# EasyEDA Pro project ProProject_LED电子时钟_2024-05-19.epro

# Schematic Schematic1
Create Date: 2024-05-07; Page Name: P1; Project Name: LED电子时钟; Schematic Name: Schematic1; Update Date: 2024-05-07; Company: 嘉立创EDA; Page Size: A4; Version: V1.0
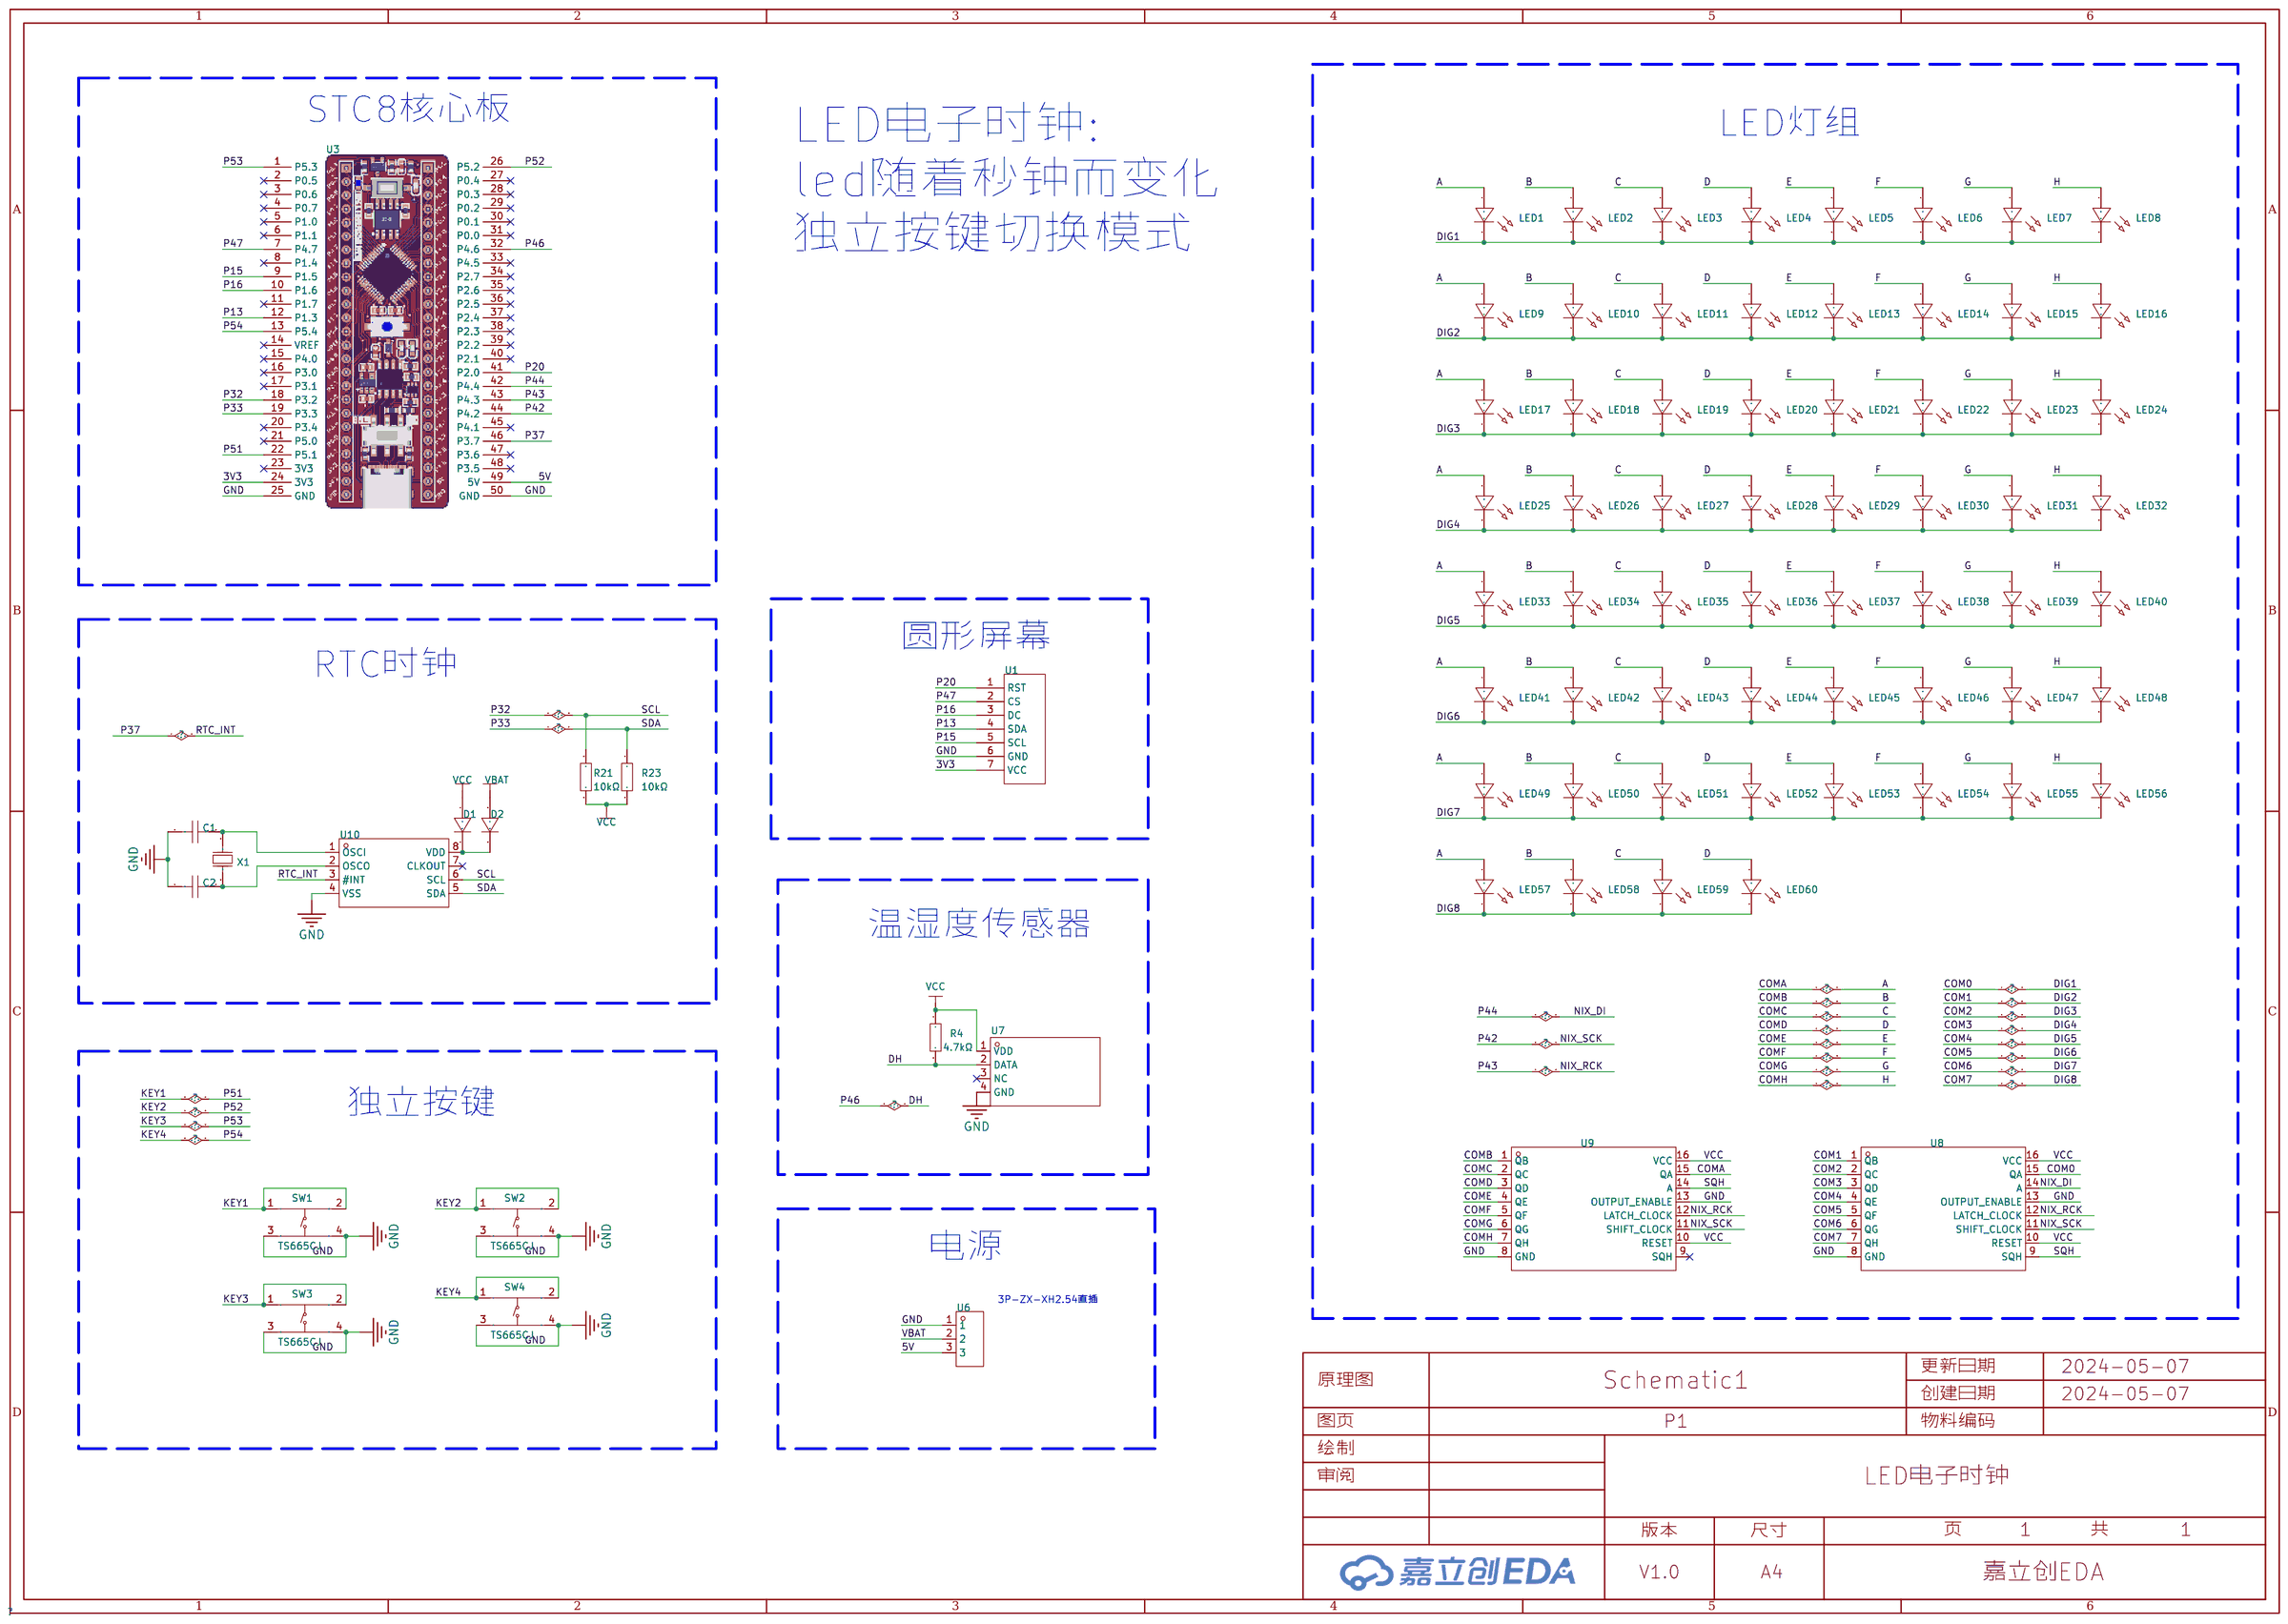
[diagram p0: schematic sheet]

## Parts
C1  12pF  [CAP-TH_L6.0-W6.0-P2.54-D1.0]
C2  12pF  [CAP-TH_L6.0-W6.0-P2.54-D1.0]
D1  -  [DO-15_BD3.1-L6.7-P10.70-D0.9-RD]
D2  -  [DO-15_BD3.1-L6.7-P10.70-D0.9-RD]
LED1  -  [LED-TH_BD3.0-P2.54-FD]
LED2  -  [LED-TH_BD3.0-P2.54-FD]
LED3  -  [LED-TH_BD3.0-P2.54-FD]
LED4  -  [LED-TH_BD3.0-P2.54-FD]
LED5  -  [LED-TH_BD3.0-P2.54-FD]
LED6  -  [LED-TH_BD3.0-P2.54-FD]
LED7  -  [LED-TH_BD3.0-P2.54-FD]
LED8  -  [LED-TH_BD3.0-P2.54-FD]
LED9  -  [LED-TH_BD3.0-P2.54-FD]
LED10  -  [LED-TH_BD3.0-P2.54-FD]
LED11  -  [LED-TH_BD3.0-P2.54-FD]
LED12  -  [LED-TH_BD3.0-P2.54-FD]
LED13  -  [LED-TH_BD3.0-P2.54-FD]
LED14  -  [LED-TH_BD3.0-P2.54-FD]
LED15  -  [LED-TH_BD3.0-P2.54-FD]
LED16  -  [LED-TH_BD3.0-P2.54-FD]
LED17  -  [LED-TH_BD3.0-P2.54-FD]
LED18  -  [LED-TH_BD3.0-P2.54-FD]
LED19  -  [LED-TH_BD3.0-P2.54-FD]
LED20  -  [LED-TH_BD3.0-P2.54-FD]
LED21  -  [LED-TH_BD3.0-P2.54-FD]
LED22  -  [LED-TH_BD3.0-P2.54-FD]
LED23  -  [LED-TH_BD3.0-P2.54-FD]
LED24  -  [LED-TH_BD3.0-P2.54-FD]
LED25  -  [LED-TH_BD3.0-P2.54-FD]
LED26  -  [LED-TH_BD3.0-P2.54-FD]
LED27  -  [LED-TH_BD3.0-P2.54-FD]
LED28  -  [LED-TH_BD3.0-P2.54-FD]
LED29  -  [LED-TH_BD3.0-P2.54-FD]
LED30  -  [LED-TH_BD3.0-P2.54-FD]
LED31  -  [LED-TH_BD3.0-P2.54-FD]
LED32  -  [LED-TH_BD3.0-P2.54-FD]
LED33  -  [LED-TH_BD3.0-P2.54-FD]
LED34  -  [LED-TH_BD3.0-P2.54-FD]
LED35  -  [LED-TH_BD3.0-P2.54-FD]
LED36  -  [LED-TH_BD3.0-P2.54-FD]
LED37  -  [LED-TH_BD3.0-P2.54-FD]
LED38  -  [LED-TH_BD3.0-P2.54-FD]
LED39  -  [LED-TH_BD3.0-P2.54-FD]
LED40  -  [LED-TH_BD3.0-P2.54-FD]
LED41  -  [LED-TH_BD3.0-P2.54-FD]
LED42  -  [LED-TH_BD3.0-P2.54-FD]
LED43  -  [LED-TH_BD3.0-P2.54-FD]
LED44  -  [LED-TH_BD3.0-P2.54-FD]
LED45  -  [LED-TH_BD3.0-P2.54-FD]
LED46  -  [LED-TH_BD3.0-P2.54-FD]
LED47  -  [LED-TH_BD3.0-P2.54-FD]
LED48  -  [LED-TH_BD3.0-P2.54-FD]
LED49  -  [LED-TH_BD3.0-P2.54-FD]
LED50  -  [LED-TH_BD3.0-P2.54-FD]
LED51  -  [LED-TH_BD3.0-P2.54-FD]
LED52  -  [LED-TH_BD3.0-P2.54-FD]
LED53  -  [LED-TH_BD3.0-P2.54-FD]
LED54  -  [LED-TH_BD3.0-P2.54-FD]
LED55  -  [LED-TH_BD3.0-P2.54-FD]
LED56  -  [LED-TH_BD3.0-P2.54-FD]
LED57  -  [LED-TH_BD3.0-P2.54-FD]
LED58  -  [LED-TH_BD3.0-P2.54-FD]
LED59  -  [LED-TH_BD3.0-P2.54-FD]
LED60  -  [LED-TH_BD3.0-P2.54-FD]
R4  4.7kΩ  [RES-TH_BD2.4-L6.3-P10.30-D0.6]
R21  10kΩ  [RES-TH_BD2.4-L6.3-P10.30-D0.6]
R23  10kΩ  [RES-TH_BD2.4-L6.3-P10.30-D0.6]
SW1  TS665CJ  [SW-TH_4P-L6.0-W6.0-P4.50-LS6.5]
SW2  TS665CJ  [SW-TH_4P-L6.0-W6.0-P4.50-LS6.5]
SW3  TS665CJ  [SW-TH_4P-L6.0-W6.0-P4.50-LS6.5]
SW4  TS665CJ  [SW-TH_4P-L6.0-W6.0-P4.50-LS6.5]
U1  -  [1.28寸OLED圆形显示屏]
U3  -  [STC8H8K64U_CORE]
U6  ZX-XH2.54-3PZZ  [CONN-TH_3P-P2.54_2501S-3P]
U7  -  [SENSOR-TH_DHT11]
U8  74HC595N  [DIP-16_L20.0-W6.4-P2.54-LS7.6-BL]
U9  74HC595N  [DIP-16_L20.0-W6.4-P2.54-LS7.6-BL]
U10  PCF8563N  [DIP-8_L9.7-W6.4-P2.54-LS7.6-BL]
X1  32.768kHz  [CRYSTAL-TH_BD2.1-P0.70-D0.3]

## Library data of the parts
C1 C2 = CC1H120KA1PDCH4B3003: 容值:12pF;精度:±10%;额定电压:50V;温度系数:NP0;脚间距:2.54mm;电容体直径:-;电容体厚度:-;; LCSC Part Name: 12pF±10%50V; Supplier Part: C353907; Manufacturer: Dersonic(德尔创); Supplier Footprint: 径向引线,P=2.54mm; JLCPCB Part Class: 扩展库; Datasheet: https://atta.szlcsc.com/upload/public/pdf/source/20181227/C353907_0D58F7ACE4E16D096B8CF295366F24DF.pdf; Supplier: LCSC; Tolerance: ±10%; Voltage Rated: 50V; Temperature Coefficient: NP0; Lead Spacing: 2.54mm
D1 D2 = 1N4004G_C232435: 二极管配置:-;直流反向耐压(Vr):400V;平均整流电流(Io):1A;正向压降(Vf):930mV@1A;反向电流(Ir):50nA@400V;; LCSC Part Name: 1N4004G; Supplier Part: C232435; Manufacturer: onsemi(安森美); Manufacturer Part: 1N4004G; Supplier Footprint: 插件,2x4.1mm; JLCPCB Part Class: 扩展库; Datasheet: https://atta.szlcsc.com/upload/public/pdf/source/20180830/C232435_7A61FC887E00F7CCC341146F4C8EE147.pdf; Supplier: LCSC; Reverse Voltage (Vr): 400V; Average Rectified Current (Io): 1A; Forward Voltage (Vf@If): 930mV@1A; Reverse Leakage Current: 50nA@400V
LED1-LED60 = LED_TH-R_3mm: Supplier Footprint: 插件
R4 R21 R23 = Res_AXIAL-1/4W: Supplier Footprint: 轴向引线
SW1-SW4 = TS665CJ: 电路结构:单刀单掷;按钮形状:圆形按钮;安装方式:直插;开关长度:6mm;开关宽度:6mm;开关高度:5mm;触点电流:50mA;额定电压(DC):12V;带灯:-;机械寿命:-;; LCSC Part Name: 6*6*5mm 直插 轻触开关; Supplier Part: C393938; Manufacturer: SHOU HAN(首韩); Supplier Footprint: 插件; JLCPCB Part Class: 扩展库; Datasheet: https://atta.szlcsc.com/upload/public/pdf/source/20190521/C393938_BDABEAC600B4C55E200A80AA129B70BC.pdf; Supplier: LCSC; Circuit: 单刀单掷; Actuator Style: 圆形按钮; Mounting Style: 直插; Switch Length: 6mm; Switch Width: 6mm; Switch Height: 5mm; Contact Current: 50mA; Voltage Rating (DC): 12V
U1 = 1.28寸圆形OLED
U3 = STC8H8K64U_CORE
U6 = ZX-XH2.54-3PZZ: 插针结构:1x3P;间距:2.54mm;安装方式:直插;参考系列:XH;总PIN数:3P;排数:1;每排PIN数:3;行距:-;额定电流:3A;触头材质:黄铜;触头镀层:锡;工作温度范围:-25℃~+85℃;; Supplier Part: C7429633; Manufacturer: Megastar(兆星); Supplier Footprint: 插件,P=2.54mm; JLCPCB Part Class: 扩展库; Datasheet: https://atta.szlcsc.com/upload/public/pdf/source/20230619/AE17037A2CFDBE8D9CBA775D61AD0A84.pdf; Supplier: LCSC; Pins Structure: 1x3P; Pitch: 2.54mm; Mounting Style: 直插; Reference Series: XH; Number of Pins: 3P; Number of Rows: 1; Number of PINs Per Row: 3; Current Rating (Max): 3A; Contact Material: 黄铜; Contact Plating: 锡; Operating Temperature Range: -25℃~+85℃
U7 = DHT11: 传感器类型:Humidity,Temperature;输出类型:-;温度范围:-;湿度范围:-;精度:-;; LCSC Part Name: DHT11电容式传感器; Supplier Part: C117051; Manufacturer: 广州奥松; Supplier Footprint: 16.1mm*12.6mm*5.8mm; JLCPCB Part Class: 扩展库; Datasheet: https://atta.szlcsc.com/upload/public/pdf/source/20170703/1499081238365.pdf; Supplier: LCSC; Sensor Type: Humidity,Temperature; Voltage-Supply: 3.3V~5.5V
U8 U9 = 74HC595N_C507175: 逻辑电路的归属系列:-;逻辑类型:-;输出类型:-;功能:-;; LCSC Part Name: 具有三态输出寄存器的8位移位寄存器; Supplier Part: C507175; Manufacturer: HGSEMI(华冠); Supplier Footprint: DIP-16; JLCPCB Part Class: 扩展库; Datasheet: https://atta.szlcsc.com/upload/public/pdf/source/20200807/C507175_E34A38F170EDB2B55E02D1AF859C319F.pdf; Supplier: LCSC
U10 = PCF8563N: 低功耗CMOS实时时钟/日历芯片; Supplier Part: C512783; Manufacturer: HGSEMI(华冠); Supplier Footprint: DIP-8; JLCPCB Part Class: 扩展库; Datasheet: https://atta.szlcsc.com/upload/public/pdf/source/20220729/54940189ABAC8F74603EDE43118FBEBE.pdf; Supplier: LCSC
X1 = Y20600327122040: 晶振类型:圆柱体晶振;频率:32.768kHz;频率公差:±10ppm;负载电容:12.5pF;等效串联电阻(ESR):40kΩ;工作温度:-20~+70;; LCSC Part Name: 32.768kHz±10ppm12.5pF; Supplier Part: C555557; Manufacturer: JGHC(晶光华); Supplier Footprint: DT-26; JLCPCB Part Class: 扩展库; Datasheet: https://atta.szlcsc.com/upload/public/pdf/source/20191012/C390737_64D6F856E7650A863FE44EA32FF6806B.pdf; Supplier: LCSC; Crystal Type: 圆柱体晶振; Frequency Tolerance: ±10ppm; Load Capacitance: 12.5pF; Equivalent Series Resistance (ESR): 40kΩ; Operating Temperature: -20~+70

## Nets
3V3: U1.7(VCC) U3.24(3V3)
5V: U3.49(5V) U6.3
GND: C1.1 C2.1 SW1.3(C) SW1.4(D) SW2.3(C) SW2.4(D) SW3.3(C) SW3.4(D) SW4.3(C) SW4.4(D) U1.6(GND) U3.25(GND) U3.50(GND) U6.1 U7.4(GND) U8.8(GND) U8.13(OUTPUT_ENABLE) U9.8(GND) U9.13(OUTPUT_ENABLE) U10.4(VSS)
VBAT: D2.2 U6.2
VCC: D1.2 R4.1 R21.1 R23.1 U7.1(VDD) U8.10(RESET) U8.16(VCC) U9.10(RESET) U9.16(VCC)
A: LED1.1(C) LED9.1(C) LED17.1(C) LED25.1(C) LED33.1(C) LED41.1(C) LED49.1(C) LED57.1(C) U9.15(QA)
B: LED2.1(C) LED10.1(C) LED18.1(C) LED26.1(C) LED34.1(C) LED42.1(C) LED50.1(C) LED58.1(C) U9.1(QB)
C: LED3.1(C) LED11.1(C) LED19.1(C) LED27.1(C) LED35.1(C) LED43.1(C) LED51.1(C) LED59.1(C) U9.2(QC)
COM0: LED1.2(A) LED2.2(A) LED3.2(A) LED4.2(A) LED5.2(A) LED6.2(A) LED7.2(A) LED8.2(A) U8.15(QA)
COM1: LED9.2(A) LED10.2(A) LED11.2(A) LED12.2(A) LED13.2(A) LED14.2(A) LED15.2(A) LED16.2(A) U8.1(QB)
COM2: LED17.2(A) LED18.2(A) LED19.2(A) LED20.2(A) LED21.2(A) LED22.2(A) LED23.2(A) LED24.2(A) U8.2(QC)
COM3: LED25.2(A) LED26.2(A) LED27.2(A) LED28.2(A) LED29.2(A) LED30.2(A) LED31.2(A) LED32.2(A) U8.3(QD)
COM4: LED33.2(A) LED34.2(A) LED35.2(A) LED36.2(A) LED37.2(A) LED38.2(A) LED39.2(A) LED40.2(A) U8.4(QE)
COM5: LED41.2(A) LED42.2(A) LED43.2(A) LED44.2(A) LED45.2(A) LED46.2(A) LED47.2(A) LED48.2(A) U8.5(QF)
COM6: LED49.2(A) LED50.2(A) LED51.2(A) LED52.2(A) LED53.2(A) LED54.2(A) LED55.2(A) LED56.2(A) U8.6(QG)
COM7: LED57.2(A) LED58.2(A) LED59.2(A) LED60.2(A) U8.7(QH)
COMD: LED4.1(C) LED12.1(C) LED20.1(C) LED28.1(C) LED36.1(C) LED44.1(C) LED52.1(C) LED60.1(C) U9.3(QD)
COME: LED5.1(C) LED13.1(C) LED21.1(C) LED29.1(C) LED37.1(C) LED45.1(C) LED53.1(C) U9.4(QE)
COMF: LED6.1(C) LED14.1(C) LED22.1(C) LED30.1(C) LED38.1(C) LED46.1(C) LED54.1(C) U9.5(QF)
COMG: LED7.1(C) LED15.1(C) LED23.1(C) LED31.1(C) LED39.1(C) LED47.1(C) LED55.1(C) U9.6(QG)
COMH: LED8.1(C) LED16.1(C) LED24.1(C) LED32.1(C) LED40.1(C) LED48.1(C) LED56.1(C) U9.7(QH)
DH: R4.2 U3.32(P4.6) U7.2(DATA)
KEY1: SW1.1(A) SW1.2(B) U3.22(P5.1)
KEY2: SW2.1(A) SW2.2(B) U3.26(P5.2)
KEY3: SW3.1(A) SW3.2(B) U3.1(P5.3)
KEY4: SW4.1(A) SW4.2(B) U3.13(P5.4)
NIX_DI: U3.42(P4.4) U8.14(A)
NIX_RCK: U3.43(P4.3) U8.12(LATCH_CLOCK) U9.12(LATCH_CLOCK)
NIX_SCK: U3.44(P4.2) U8.11(SHIFT_CLOCK) U9.11(SHIFT_CLOCK)
P13: U1.4(SDA) U3.12(P1.3)
P15: U1.5(SCL) U3.9(P1.5)
P16: U1.3(DC) U3.10(P1.6)
P20: U1.1(RST) U3.41(P2.0)
P32: R21.2 U3.18(P3.2) U10.6(SCL)
P33: R23.2 U3.19(P3.3) U10.5(SDA)
P37: U3.46(P3.7) U10.3(#INT)
P47: U1.2(CS) U3.7(P4.7)
SQH: U8.9(SQH) U9.14(A)
$1N7289: D1.1 D2.1 U10.8(VDD)
$1N7298: C2.2 U10.2(OSCO) X1.2(OSC2)
$1N7299: C1.2 U10.1(OSCI) X1.1(OSC1)

Not connected (* = marked no-connect by the designer): U3 2(P0.5)* 3(P0.6)* 4(P0.7)* 5(P1.0)* 6(P1.1)* 8(P1.4)* 11(P1.7)* 14(VREF)* 15(P4.0)* 16(P3.0)* 17(P3.1)* 20(P3.4)* 21(P5.0)* 23(3V3)* 27(P0.4)* 28(P0.3)* 29(P0.2)* 30(P0.1)* 31(P0.0)* 33(P4.5)* 34(P2.7)* 35(P2.6)* 36(P2.5)* 37(P2.4)* 38(P2.3)* 39(P2.2)* 40(P2.1)* 45(P4.1)* 47(P3.6)* 48(P3.5)*; U7 3(NC)*; U9 9(SQH)*; U10 7(CLKOUT)*

## Notes on the sheet
- STC8核心板
- LED灯组
- LED电子时钟:
  led随着秒钟而变化
  独立按键切换模式
- 圆形屏幕
- RTC时钟
- 温湿度传感器
- 独立按键
- 电源
- 3P-ZX-XH2.54直插

# Board PCB1
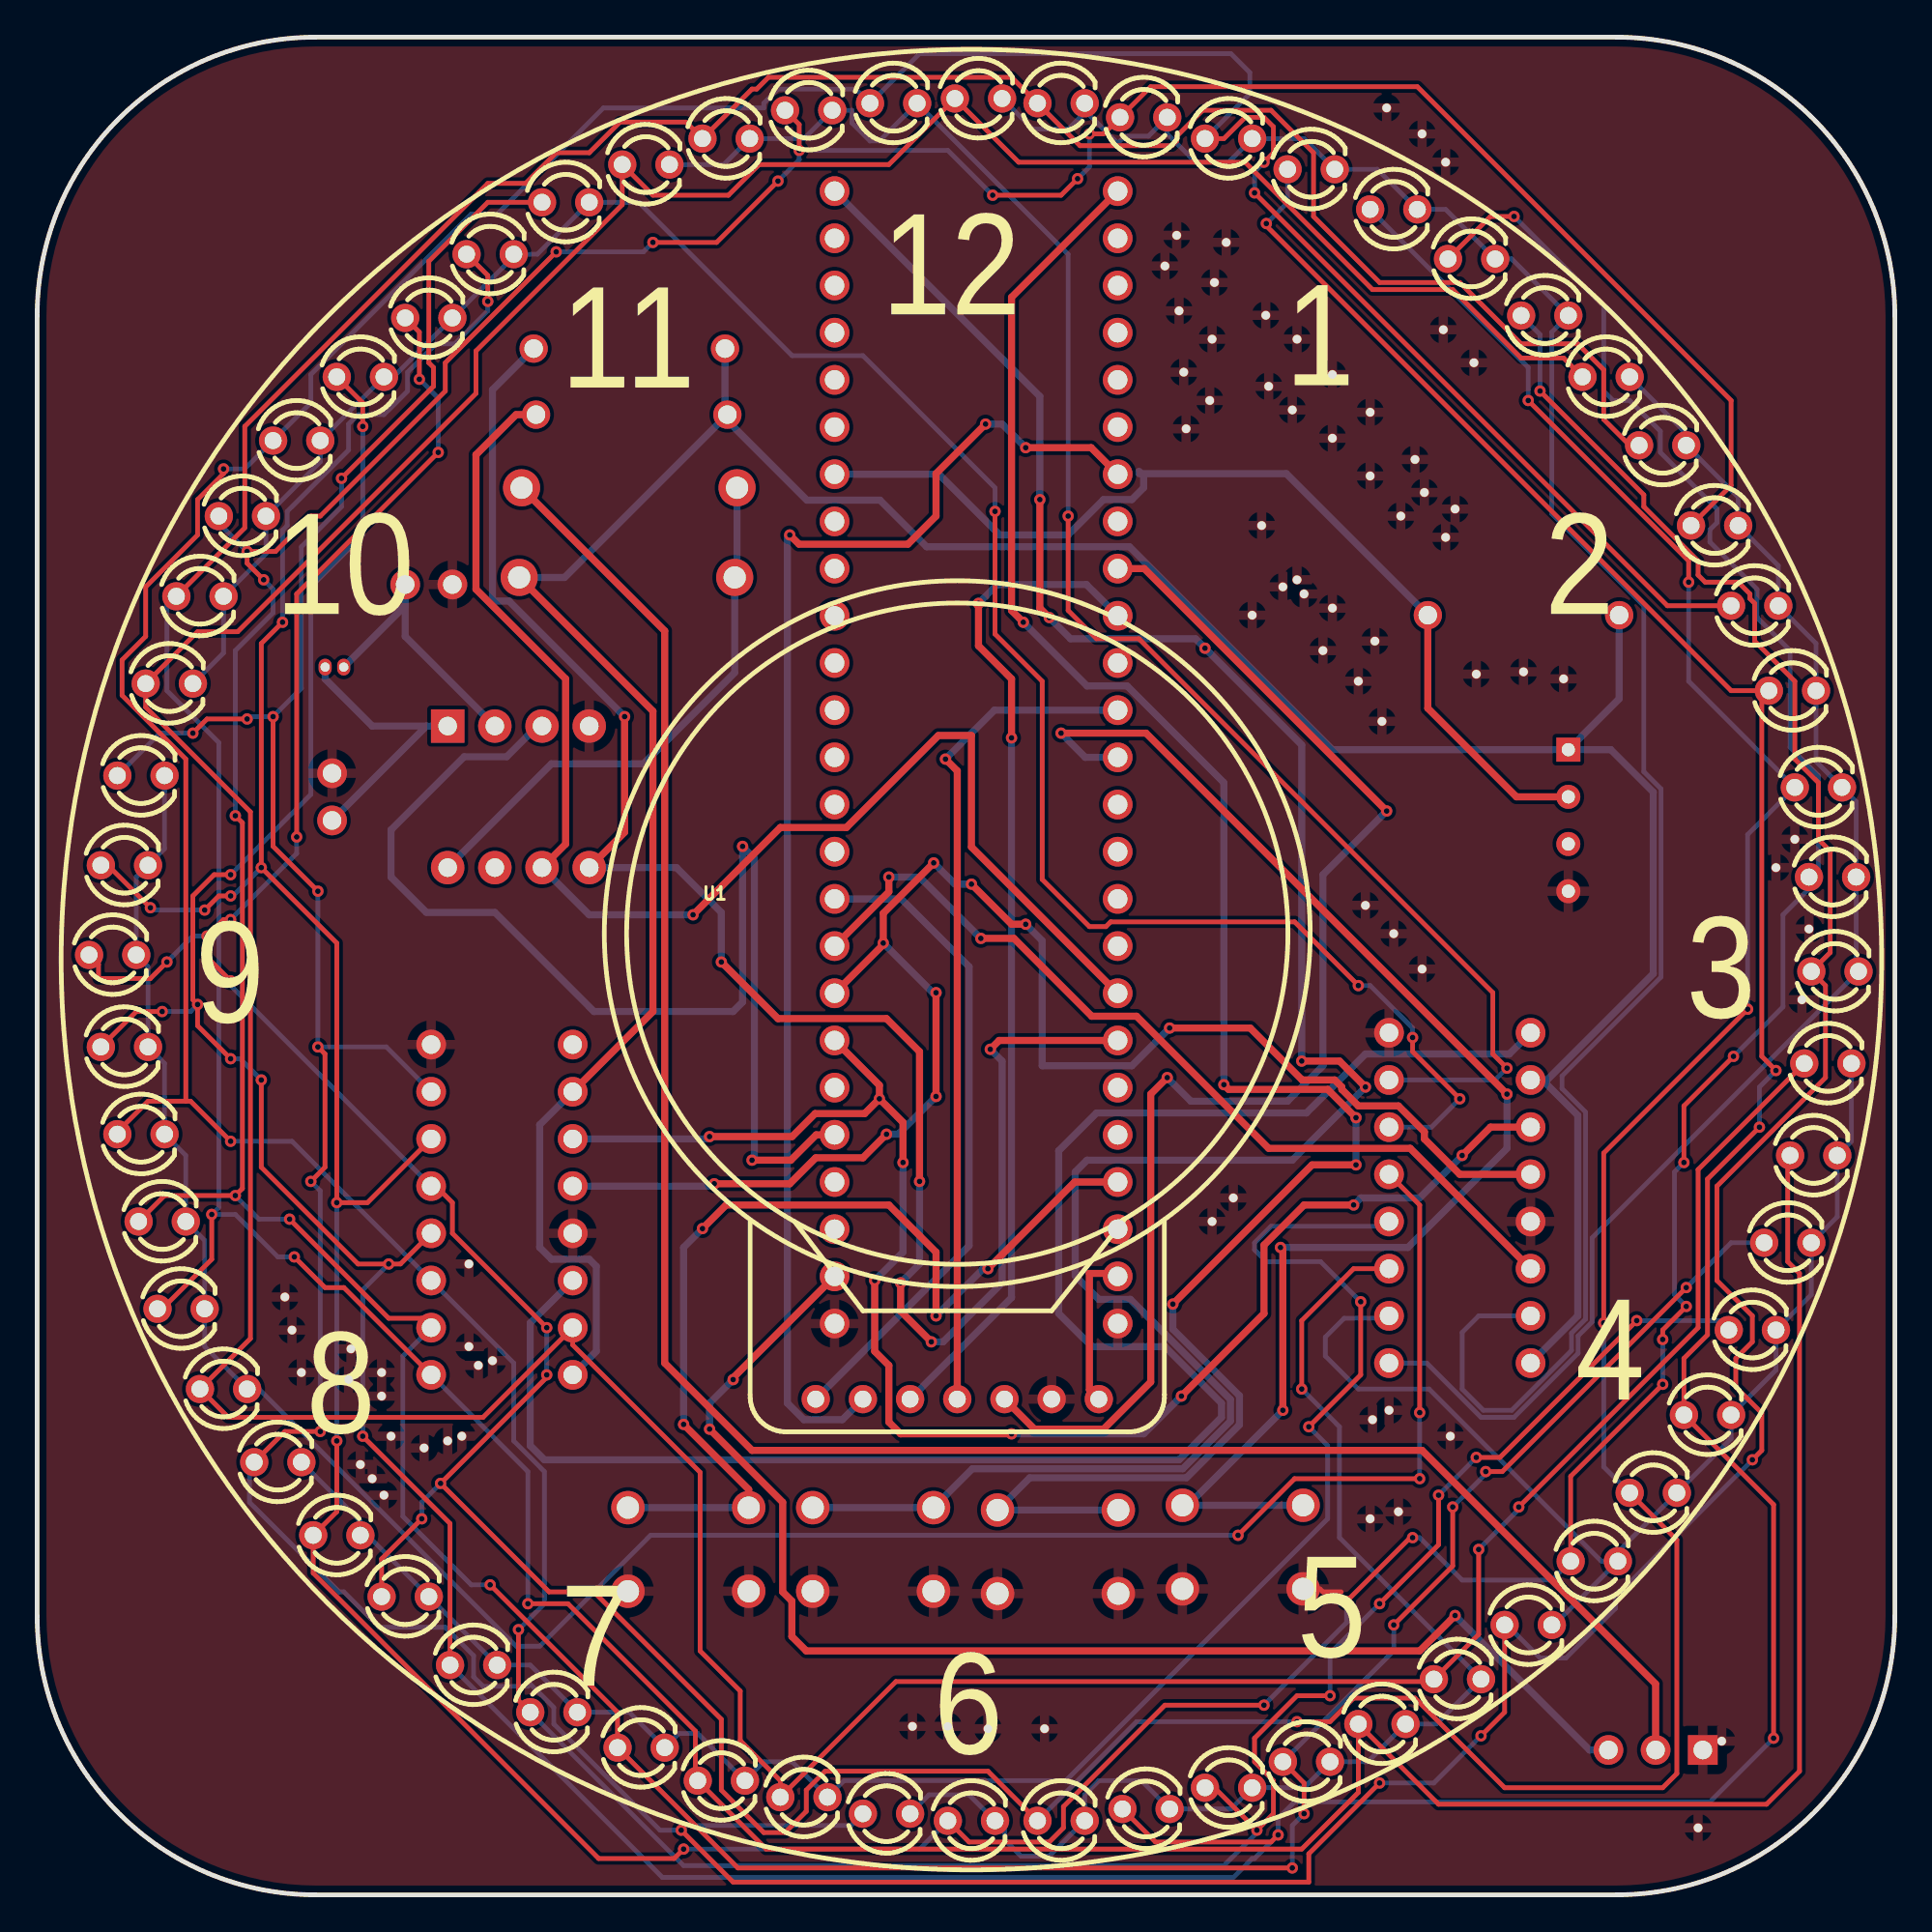
[diagram p1: board, top side]
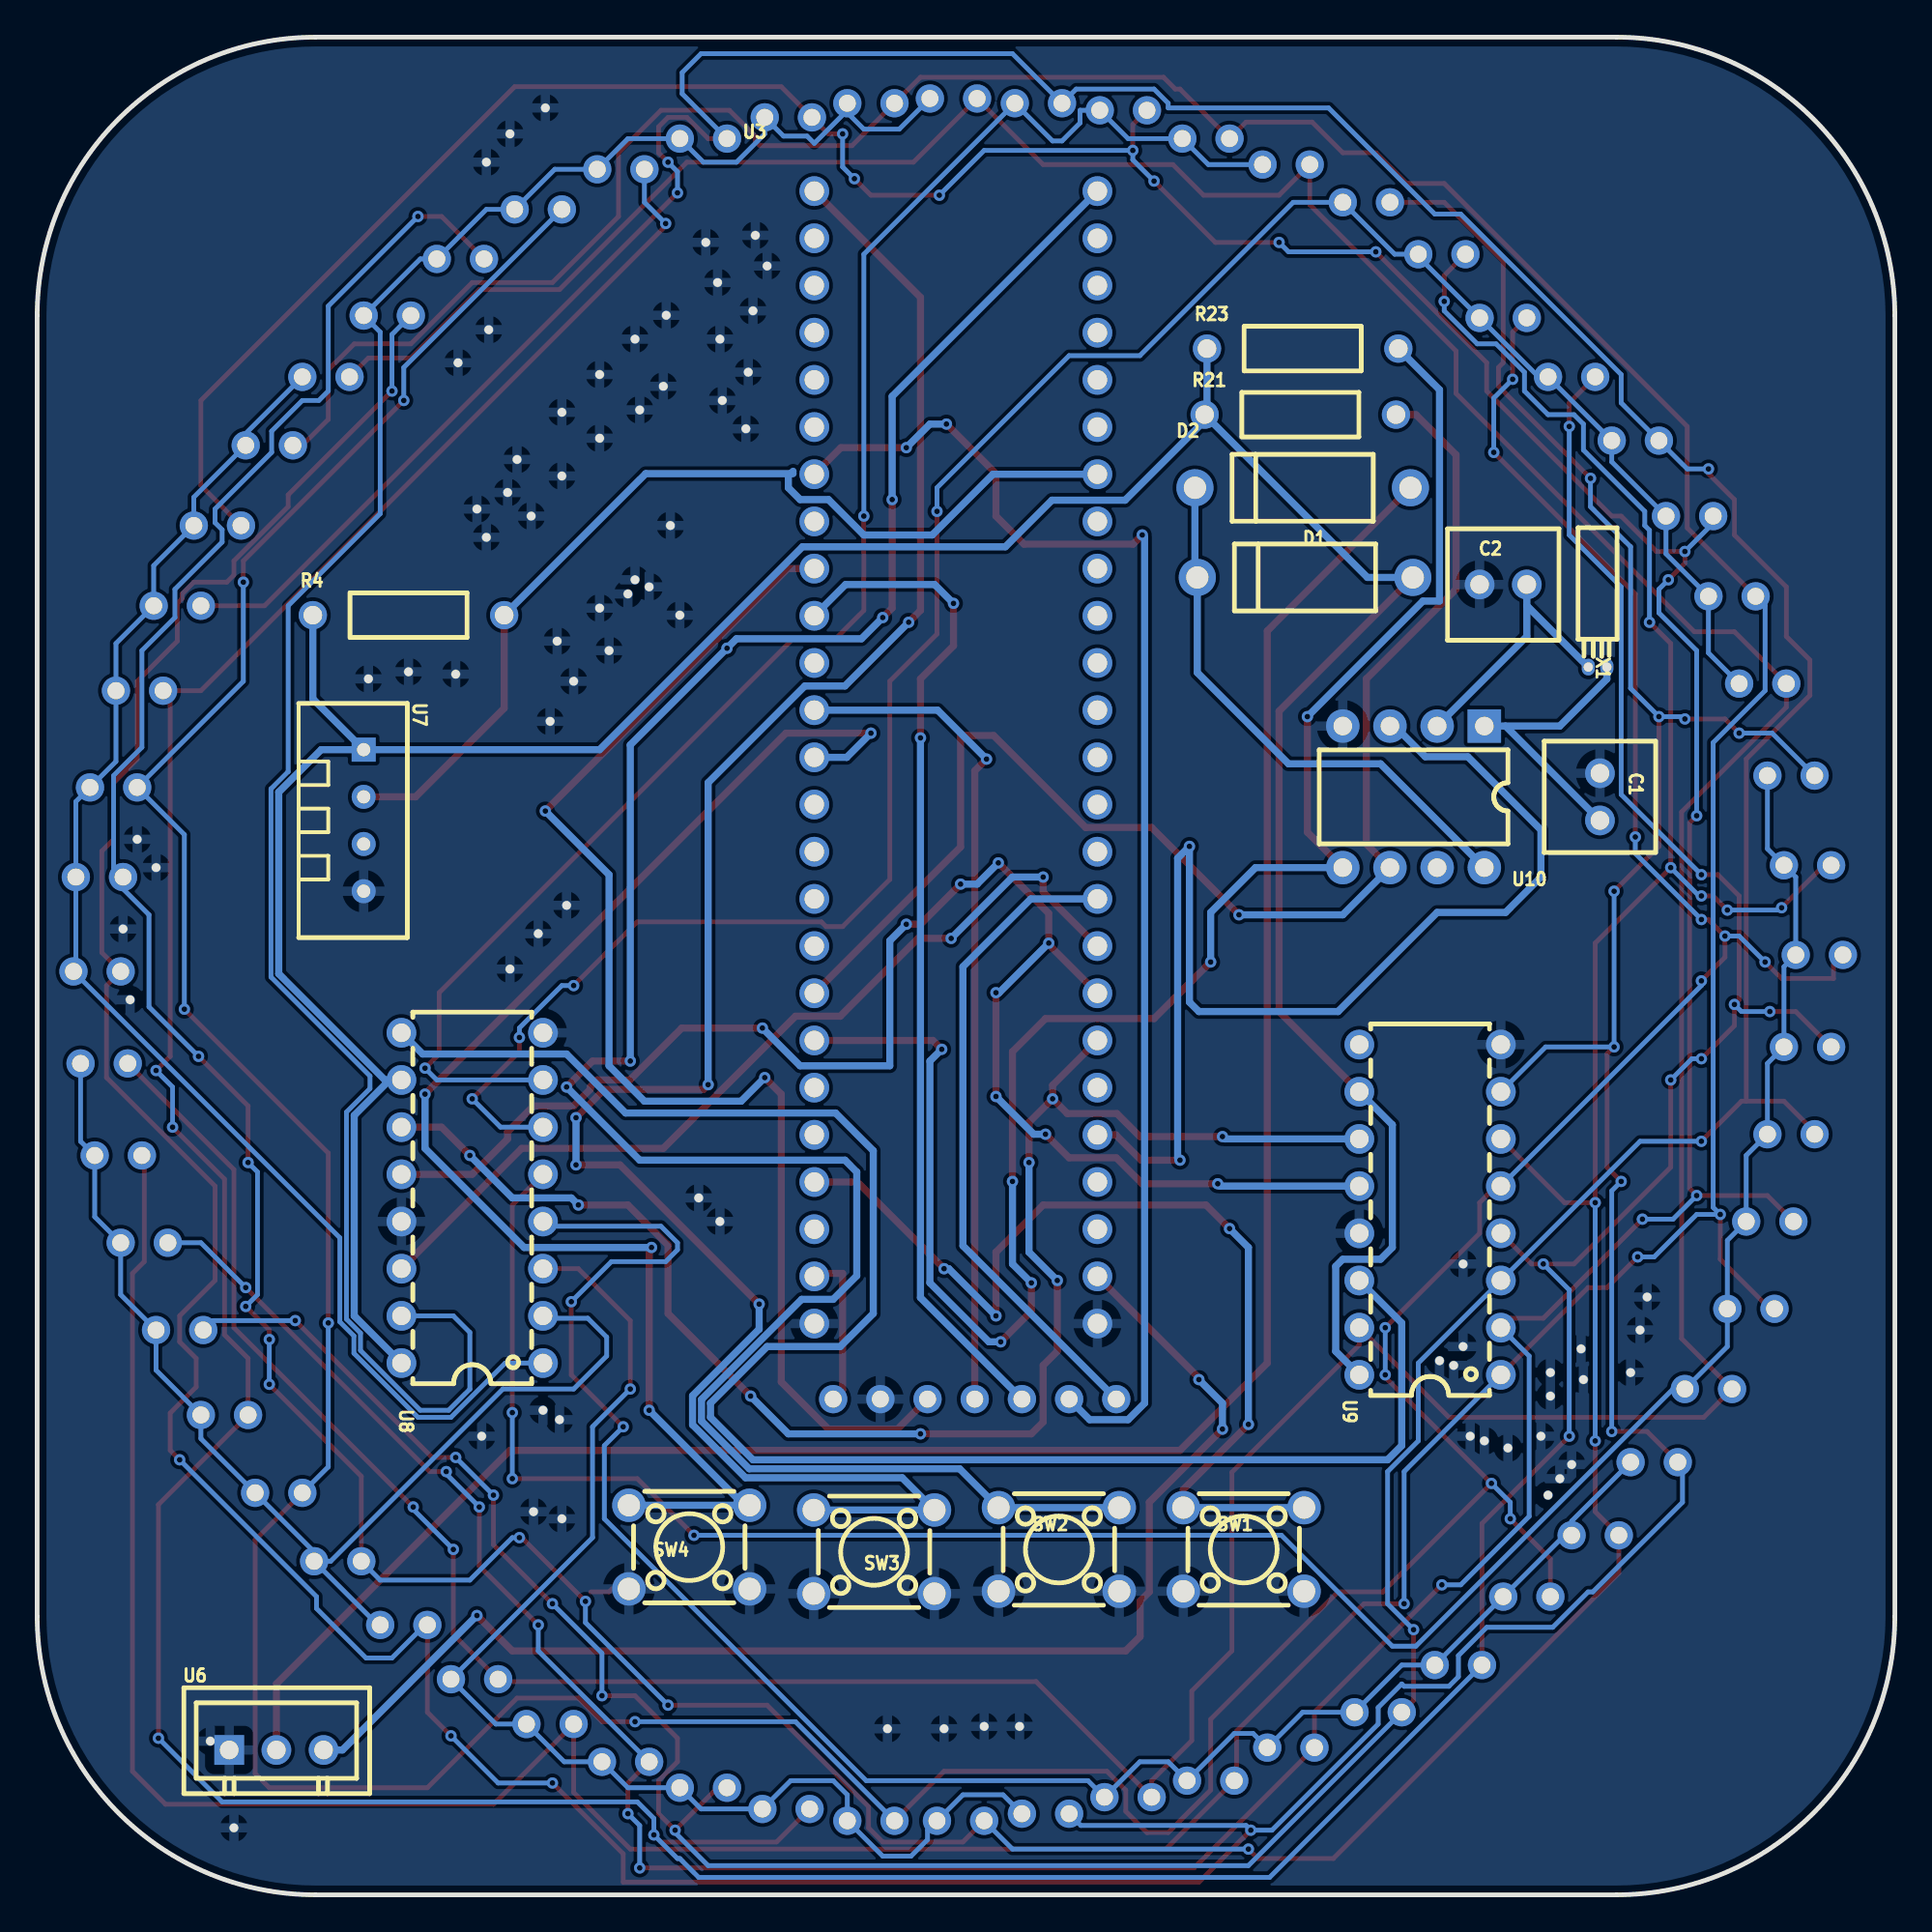
[diagram p2: board, bottom side, seen from below]

Outline 100 x 100 mm; copper layers: Top Layer, Bottom Layer. Coordinates in mm from the lower left corner of the outline.
Outline path: 0,85 0,15 arc(4.39,4.39) 15,0 85,0 arc(95.61,4.39) 100,15 100,85 arc(95.61,95.61) 85,100 15,100 arc(4.39,95.61) 0,85
Stack: Top Layer 0.035mm / Dielectric1 1.51mm FR4 er 4.5 / Bottom Layer 0.035mm

## Design rules (mm)
template: JLCPCB Capability(Two Layers Board)
spacing copperThickness1oz (default): track to track 0.102, other pairs 0.152 to 0.3
spacing copperThickness2oz: track to track 0.203, other pairs 0.152 to 0.3
track width copperThickness1oz (default): min 0.127, default 0.254, max 2.54
track width copperThickness2oz: min 0.203, default 0.254, max 2.54
differential pair differentialPair (default): width min 0.127, default 0.254, max 2.54; gap min 0.152, default 0.152
via viaSize (default): diameter min 0.5, default 0.61, max 10; hole min 0.3, default 0.305, max 6.3

## Placement (name value [footprint] x y rotation side)
C1  12pF  [CAP-TH_L6.0-W6.0-P2.54-D1.0]  15.88 59.11 270 bottom
C2  12pF  [CAP-TH_L6.0-W6.0-P2.54-D1.0]  21.08 70.54 180 bottom
D1  -  [DO-15_BD3.1-L6.7-P10.70-D0.9-RD]  31.75 70.92 180 bottom
D2  -  [DO-15_BD3.1-L6.7-P10.70-D0.9-RD]  31.88 75.74 180 bottom
LED1  -  [LED-TH_BD3.0-P2.54-FD]  50.67 96.7 0 top
LED2  -  [LED-TH_BD3.0-P2.54-FD]  55.12 96.44 0 top
LED3  -  [LED-TH_BD3.0-P2.54-FD]  59.56 95.68 0 top
LED4  -  [LED-TH_BD3.0-P2.54-FD]  64.14 94.54 0 top
LED5  -  [LED-TH_BD3.0-P2.54-FD]  68.58 92.89 0 top
LED6  -  [LED-TH_BD3.0-P2.54-FD]  73.03 90.73 0 top
LED7  -  [LED-TH_BD3.0-P2.54-FD]  77.22 88.06 0 top
LED8  -  [LED-TH_BD3.0-P2.54-FD]  81.15 85.01 0 top
LED9  -  [LED-TH_BD3.0-P2.54-FD]  84.45 81.71 0 top
LED10  -  [LED-TH_BD3.0-P2.54-FD]  87.5 78.03 0 top
LED11  -  [LED-TH_BD3.0-P2.54-FD]  90.3 73.71 0 top
LED12  -  [LED-TH_BD3.0-P2.54-FD]  92.46 69.39 0 top
LED13  -  [LED-TH_BD3.0-P2.54-FD]  94.49 64.82 0 top
LED14  -  [LED-TH_BD3.0-P2.54-FD]  95.89 59.61 0 top
LED15  -  [LED-TH_BD3.0-P2.54-FD]  96.65 54.79 0 top
LED16  -  [LED-TH_BD3.0-P2.54-FD]  96.77 49.71 0 top
LED17  -  [LED-TH_BD3.0-P2.54-FD]  96.39 44.75 0 top
LED18  -  [LED-TH_BD3.0-P2.54-FD]  95.63 39.8 0 top
LED19  -  [LED-TH_BD3.0-P2.54-FD]  94.23 35.1 0 top
LED20  -  [LED-TH_BD3.0-P2.54-FD]  92.33 30.4 0 top
LED21  -  [LED-TH_BD3.0-P2.54-FD]  89.92 25.83 0 top
LED22  -  [LED-TH_BD3.0-P2.54-FD]  87 21.64 0 top
LED23  -  [LED-TH_BD3.0-P2.54-FD]  83.82 17.96 0 top
LED24  -  [LED-TH_BD3.0-P2.54-FD]  80.26 14.53 0 top
LED25  -  [LED-TH_BD3.0-P2.54-FD]  76.45 11.61 0 top
LED26  -  [LED-TH_BD3.0-P2.54-FD]  72.39 9.19 0 top
LED27  -  [LED-TH_BD3.0-P2.54-FD]  68.33 7.16 0 top
LED28  -  [LED-TH_BD3.0-P2.54-FD]  64.14 5.77 0 top
LED29  -  [LED-TH_BD3.0-P2.54-FD]  59.69 4.62 0 top
LED30  -  [LED-TH_BD3.0-P2.54-FD]  55.12 3.99 0 top
LED31  -  [LED-TH_BD3.0-P2.54-FD]  50.29 3.99 0 top
LED32  -  [LED-TH_BD3.0-P2.54-FD]  45.72 4.37 0 top
LED33  -  [LED-TH_BD3.0-P2.54-FD]  41.28 5.26 0 top
LED34  -  [LED-TH_BD3.0-P2.54-FD]  36.83 6.15 0 top
LED35  -  [LED-TH_BD3.0-P2.54-FD]  32.51 7.93 0 top
LED36  -  [LED-TH_BD3.0-P2.54-FD]  27.81 9.83 0 top
LED37  -  [LED-TH_BD3.0-P2.54-FD]  23.5 12.37 0 top
LED38  -  [LED-TH_BD3.0-P2.54-FD]  19.81 16.05 0 top
LED39  -  [LED-TH_BD3.0-P2.54-FD]  16.13 19.35 0 top
LED40  -  [LED-TH_BD3.0-P2.54-FD]  12.95 23.29 0 top
LED41  -  [LED-TH_BD3.0-P2.54-FD]  10.03 27.23 0 top
LED42  -  [LED-TH_BD3.0-P2.54-FD]  7.75 31.55 0 top
LED43  -  [LED-TH_BD3.0-P2.54-FD]  6.73 36.25 0 top
LED44  -  [LED-TH_BD3.0-P2.54-FD]  5.59 40.94 0 top
LED45  -  [LED-TH_BD3.0-P2.54-FD]  4.7 45.64 0 top
LED46  -  [LED-TH_BD3.0-P2.54-FD]  4.06 50.6 0 top
LED47  -  [LED-TH_BD3.0-P2.54-FD]  4.7 55.42 0 top
LED48  -  [LED-TH_BD3.0-P2.54-FD]  5.59 60.25 0 top
LED49  -  [LED-TH_BD3.0-P2.54-FD]  7.11 65.2 0 top
LED50  -  [LED-TH_BD3.0-P2.54-FD]  8.76 69.9 0 top
LED51  -  [LED-TH_BD3.0-P2.54-FD]  11.05 74.22 0 top
LED52  -  [LED-TH_BD3.0-P2.54-FD]  13.97 78.28 0 top
LED53  -  [LED-TH_BD3.0-P2.54-FD]  17.4 81.71 0 top
LED54  -  [LED-TH_BD3.0-P2.54-FD]  21.08 84.89 0 top
LED55  -  [LED-TH_BD3.0-P2.54-FD]  24.38 88.32 0 top
LED56  -  [LED-TH_BD3.0-P2.54-FD]  28.45 91.11 0 top
LED57  -  [LED-TH_BD3.0-P2.54-FD]  32.77 93.14 0 top
LED58  -  [LED-TH_BD3.0-P2.54-FD]  37.08 94.54 0 top
LED59  -  [LED-TH_BD3.0-P2.54-FD]  41.53 96.06 0 top
LED60  -  [LED-TH_BD3.0-P2.54-FD]  46.1 96.44 0 top
NOREF  -  [Pad_e48119]  17.4 23.16 0 top
NOREF#2  -  [Pad_e47704]  64.39 37.52 0 top
NOREF#3  -  [Pad_e47329]  66.14 85.03 0 top
NOREF#4  -  [Pad_e46805]  90.68 8.27 0 top
NOREF#5  -  [Pad_e46650]  89.41 3.61 0 top
NOREF#6  -  [Pad_e47356]  64.01 88.95 0 top
NOREF#7  -  [Pad_e47349]  72.01 67.49 0 top
NOREF#8  -  [Pad_e47352]  77.47 65.71 0 top
NOREF#9  -  [Pad_e47690]  71.5 53.26 0 top
NOREF#10  -  [Pad_e47348]  71.12 65.33 0 top
NOREF#11  -  [Pad_e47694]  77.34 82.47 0 top
NOREF#12  -  [Pad_e47702]  20.83 24.05 0 top
NOREF#13  -  [Pad_e47335]  67.56 79.93 0 top
NOREF#14  -  [Pad_e47347]  69.22 66.98 0 top
NOREF#15  -  [Pad_e47344]  68.2 70.03 0 top
NOREF#16  -  [Pad_e47695]  72.64 96.19 0 top
NOREF#17  -  [Pad_e47339]  75.82 73.08 0 top
NOREF#18  -  [Pad_e47689]  54.23 8.94 0 top
NOREF#19  -  [Pad_e47330]  67.82 83.74 0 top
NOREF#20  -  [Pad_e47368]  76.07 24.69 0 top
NOREF#21  -  [Pad_e48120]  18.03 22.4 0 top
NOREF#22  -  [Pad_e46802]  89.66 7.8 0 top
NOREF#23  -  [Pad_e47686]  47.12 9.07 0 top
NOREF#24  -  [Pad_e47332]  71.76 79.81 0 top
NOREF#25  -  [Pad_e47366]  71.88 25.58 0 top
NOREF#26  -  [Pad_e47688]  51.18 8.94 0 top
NOREF#27  -  [Pad_e47355]  61.34 89.33 0 top
NOREF#28  -  [Pad_e47698]  13.72 30.4 0 top
NOREF#29  -  [Pad_e48124]  24.51 28.75 0 top
NOREF#30  -  [Pad_e47364]  71.76 20.24 0 top
NOREF#31  -  [Pad_e47359]  61.47 85.27 0 top
NOREF#32  -  [Pad_e47343]  67.82 70.79 0 top
NOREF#33  -  [Pad_e47361]  61.72 81.97 0 top
NOREF#34  -  [Pad_e47354]  72.39 63.17 0 top
NOREF#35  -  [Pad_e47696]  74.55 94.79 0 top
NOREF#36  -  [Pad_e47340]  76.33 74.6 0 top
NOREF#37  -  [Pad_e47350]  65.91 73.71 0 top
NOREF#38  -  [Pad_e47699]  14.22 28.12 0 top
NOREF#39  -  [Pad_e47691]  73.03 51.74 0 top
NOREF#40  -  [Pad_e47693]  75.69 84.25 0 top
NOREF#41  -  [Pad_e48113]  16.89 29.39 0 top
NOREF#42  -  [Pad_e47345]  69.72 69.27 0 top
NOREF#43  -  [Pad_e48570]  23.24 33.96 0 top
NOREF#44  -  [Pad_e47687]  49.02 9.07 0 top
NOREF#45  -  [Pad_e47346]  65.41 68.89 0 top
NOREF#46  -  [Pad_e47338]  73.41 74.22 0 top
NOREF#47  -  [Pad_e47336]  69.72 78.41 0 top
NOREF#48  -  [Pad_e47706]  94.61 56.82 0 top
NOREF#49  -  [Pad_e47357]  60.71 87.68 0 top
NOREF#50  -  [Pad_e48117]  22.86 24.69 0 top
NOREF#51  -  [Pad_e47708]  95.38 51.99 0 top
NOREF#52  -  [Pad_e47342]  67.06 70.41 0 top
NOREF#53  -  [Pad_e47334]  66.29 81.2 0 top
NOREF#54  -  [Pad_e48121]  18.67 21.51 0 top
NOREF#55  -  [Pad_e48114]  16.76 27.74 0 top
NOREF#56  -  [Pad_e47337]  71.76 76.38 0 top
NOREF#57  -  [Pad_e47363]  61.85 78.92 0 top
NOREF#58  -  [Pad_e47333]  74.17 77.27 0 top
NOREF#59  -  [Pad_e47341]  74.68 75.49 0 top
NOREF#60  -  [Pad_e47360]  63.25 83.74 0 top
NOREF#61  -  [Pad_e47705]  63.25 36.25 0 top
NOREF#62  -  [Pad_e48116]  22.1 24.44 0 top
NOREF#63  -  [Pad_e47351]  80.01 65.84 0 top
NOREF#64  -  [Pad_e47697]  75.82 93.27 0 top
NOREF#65  -  [Pad_e47362]  63.12 80.44 0 top
NOREF#66  -  [Pad_e47331]  69.72 81.84 0 top
NOREF#67  -  [Pad_e47703]  23.24 29.52 0 top
NOREF#68  -  [Pad_e48123]  23.75 28.5 0 top
NOREF#69  -  [Pad_e47692]  74.55 49.83 0 top
NOREF#70  -  [Pad_e48112]  18.54 26.85 0 top
NOREF#71  -  [Pad_e47707]  93.6 55.3 0 top
NOREF#72  -  [Pad_e47365]  73.28 20.62 0 top
NOREF#73  -  [Pad_e47353]  82.17 65.46 0 top
NOREF#74  -  [Pad_e48118]  19.05 24.69 0 top
NOREF#75  -  [Pad_e47367]  72.77 26.09 0 top
NOREF#76  -  [Pad_e47700]  13.34 32.18 0 top
NOREF#77  -  [Pad_e47709]  95 48.18 0 top
NOREF#78  -  [Pad_e47701]  18.54 28.12 0 top
NOREF#79  -  [Pad_e47358]  63.37 86.79 0 top
R4  4.7kΩ  [RES-TH_BD2.4-L6.3-P10.30-D0.6]  80.01 68.89 180 bottom
R21  10kΩ  [RES-TH_BD2.4-L6.3-P10.30-D0.6]  32 79.68 180 bottom
R23  10kΩ  [RES-TH_BD2.4-L6.3-P10.30-D0.6]  31.88 83.24 180 bottom
SW1  TS665CJ  [SW-TH_4P-L6.0-W6.0-P4.50-LS6.5]  35.05 18.59 180 bottom
SW2  TS665CJ  [SW-TH_4P-L6.0-W6.0-P4.50-LS6.5]  45 18.59 180 bottom
SW3  TS665CJ  [SW-TH_4P-L6.0-W6.0-P4.50-LS6.5]  54.95 18.47 180 bottom
SW4  TS665CJ  [SW-TH_4P-L6.0-W6.0-P4.50-LS6.5]  64.9 18.72 180 bottom
U1  -  [1.28寸OLED圆形显示屏]  49.53 51.74 0 top
U3  -  [STC8H8K64U_CORE]  50.55 61.23 180 bottom
U6  ZX-XH2.54-3PZZ  [CONN-TH_3P-P2.54_2501S-3P]  87.12 7.8 180 bottom
U7  -  [SENSOR-TH_DHT11]  82.42 57.84 270 bottom
U8  74HC595N  [DIP-16_L20.0-W6.4-P2.54-LS7.6-BL]  76.58 37.52 90 bottom
U9  74HC595N  [DIP-16_L20.0-W6.4-P2.54-LS7.6-BL]  25.02 36.88 90 bottom
U10  PCF8563N  [DIP-8_L9.7-W6.4-P2.54-LS7.6-BL]  25.91 59.11 0 bottom
X1  32.768kHz  [CRYSTAL-TH_BD2.1-P0.70-D0.3]  16 66.09 270 bottom

## Footprints (pads in the part's own frame, mm; a bottom-side part is the same pattern mirrored in y, then rotated)
1.28寸OLED圆形显示屏
  round 1.524 hole 0.914: 1(-7.62,-25.054) 2(-5.08,-25.054) 3(-2.54,-25.054) 4(0,-25.054) 5(2.54,-25.054) 6(5.08,-25.054) 7(7.62,-25.054)
CAP-TH_L6.0-W6.0-P2.54-D1.0
  round 1.6 hole 1.001: 1(-1.27,0) 2(1.27,0)
CONN-TH_3P-P2.54_2501S-3P
  rect 1.6x1.6 hole 1: 1(-2.54,0)
  round 1.6 hole 1: 2(0,0) 3(2.54,0)
CRYSTAL-TH_BD2.1-P0.70-D0.3
  oval 0.9x0.7 hole 0.5: 1(0,0.5) 2(0,-0.5)
DIP-8_L9.7-W6.4-P2.54-LS7.6-BL
  rect 1.8x1.8 hole 1: 1(-3.81,-3.81)
  round 1.8 hole 1: 2(-1.27,-3.81) 3(1.27,-3.81) 4(3.81,-3.81) 5(3.81,3.81) 6(1.27,3.81) 7(-1.27,3.81) 8(-3.81,3.81)
DIP-16_L20.0-W6.4-P2.54-LS7.6-BL
  round 1.6 hole 1: 1(-8.89,-3.81) 2(-6.35,-3.81) 3(-3.81,-3.81) 4(-1.27,-3.81) 5(1.27,-3.81) 6(3.81,-3.81) 7(6.35,-3.81) 8(8.89,-3.81) 9(8.89,3.81) 10(6.35,3.81) 11(3.81,3.81) 12(1.27,3.81) 13(-1.27,3.81) 14(-3.81,3.81) 15(-6.35,3.81) 16(-8.89,3.81)
DO-15_BD3.1-L6.7-P10.70-D0.9-RD
  round 1.999 hole 1.199: 1(-5.799,0) 2(5.801,0)
LED-TH_BD3.0-P2.54-FD
  round 1.524 hole 0.914: 1(-1.27,0) 2(1.27,0)
Pad_e46650
  round 0.508 hole 0.457: 51(0,0)
Pad_e46802
  round 0.508 hole 0.457: 52(0,0)
Pad_e46805
  round 0.508 hole 0.457: 54(0,0)
Pad_e47329
  round 0.508 hole 0.457: 51(0,0)
Pad_e47330
  round 0.508 hole 0.457: 53(0,0)
Pad_e47331
  round 0.508 hole 0.457: 55(0,0)
Pad_e47332
  round 0.508 hole 0.457: 56(0,0)
Pad_e47333
  round 0.508 hole 0.457: 57(0,0)
Pad_e47334
  round 0.508 hole 0.457: 58(0,0)
Pad_e47335
  round 0.508 hole 0.457: 59(0,0)
Pad_e47336
  round 0.508 hole 0.457: 60(0,0)
Pad_e47337
  round 0.508 hole 0.457: 61(0,0)
Pad_e47338
  round 0.508 hole 0.457: 62(0,0)
Pad_e47339
  round 0.508 hole 0.457: 63(0,0)
Pad_e47340
  round 0.508 hole 0.457: 64(0,0)
Pad_e47341
  round 0.508 hole 0.457: 65(0,0)
Pad_e47342
  round 0.508 hole 0.457: 66(0,0)
Pad_e47343
  round 0.508 hole 0.457: 67(0,0)
Pad_e47344
  round 0.508 hole 0.457: 68(0,0)
Pad_e47345
  round 0.508 hole 0.457: 69(0,0)
Pad_e47346
  round 0.508 hole 0.457: 70(0,0)
Pad_e47347
  round 0.508 hole 0.457: 71(0,0)
Pad_e47348
  round 0.508 hole 0.457: 72(0,0)
Pad_e47349
  round 0.508 hole 0.457: 73(0,0)
Pad_e47350
  round 0.508 hole 0.457: 74(0,0)
Pad_e47351
  round 0.508 hole 0.457: 75(0,0)
Pad_e47352
  round 0.508 hole 0.457: 76(0,0)
Pad_e47353
  round 0.508 hole 0.457: 77(0,0)
Pad_e47354
  round 0.508 hole 0.457: 78(0,0)
Pad_e47355
  round 0.508 hole 0.457: 79(0,0)
Pad_e47356
  round 0.508 hole 0.457: 80(0,0)
Pad_e47357
  round 0.508 hole 0.457: 81(0,0)
Pad_e47358
  round 0.508 hole 0.457: 82(0,0)
Pad_e47359
  round 0.508 hole 0.457: 83(0,0)
Pad_e47360
  round 0.508 hole 0.457: 84(0,0)
Pad_e47361
  round 0.508 hole 0.457: 85(0,0)
Pad_e47362
  round 0.508 hole 0.457: 86(0,0)
Pad_e47363
  round 0.508 hole 0.457: 87(0,0)
Pad_e47364
  round 0.508 hole 0.457: 88(0,0)
Pad_e47365
  round 0.508 hole 0.457: 89(0,0)
Pad_e47366
  round 0.508 hole 0.457: 90(0,0)
Pad_e47367
  round 0.508 hole 0.457: 91(0,0)
Pad_e47368
  round 0.508 hole 0.457: 92(0,0)
Pad_e47686
  round 0.508 hole 0.457: 93(0,0)
Pad_e47687
  round 0.508 hole 0.457: 94(0,0)
Pad_e47688
  round 0.508 hole 0.457: 95(0,0)
Pad_e47689
  round 0.508 hole 0.457: 96(0,0)
Pad_e47690
  round 0.508 hole 0.457: 97(0,0)
Pad_e47691
  round 0.508 hole 0.457: 98(0,0)
Pad_e47692
  round 0.508 hole 0.457: 99(0,0)
Pad_e47693
  round 0.508 hole 0.457: 100(0,0)
Pad_e47694
  round 0.508 hole 0.457: 101(0,0)
Pad_e47695
  round 0.508 hole 0.457: 102(0,0)
Pad_e47696
  round 0.508 hole 0.457: 103(0,0)
Pad_e47697
  round 0.508 hole 0.457: 104(0,0)
Pad_e47698
  round 0.508 hole 0.457: 105(0,0)
Pad_e47699
  round 0.508 hole 0.457: 106(0,0)
Pad_e47700
  round 0.508 hole 0.457: 107(0,0)
Pad_e47701
  round 0.508 hole 0.457: 108(0,0)
Pad_e47702
  round 0.508 hole 0.457: 109(0,0)
Pad_e47703
  round 0.508 hole 0.457: 110(0,0)
Pad_e47704
  round 0.508 hole 0.457: 111(0,0)
Pad_e47705
  round 0.508 hole 0.457: 112(0,0)
Pad_e47706
  round 0.508 hole 0.457: 113(0,0)
Pad_e47707
  round 0.508 hole 0.457: 114(0,0)
Pad_e47708
  round 0.508 hole 0.457: 115(0,0)
Pad_e47709
  round 0.508 hole 0.457: 116(0,0)
Pad_e48112
  round 0.508 hole 0.457: 117(0,0)
Pad_e48113
  round 0.508 hole 0.457: 118(0,0)
Pad_e48114
  round 0.508 hole 0.457: 119(0,0)
Pad_e48116
  round 0.508 hole 0.457: 120(0,0)
Pad_e48117
  round 0.508 hole 0.457: 121(0,0)
Pad_e48118
  round 0.508 hole 0.457: 122(0,0)
Pad_e48119
  round 0.508 hole 0.457: 123(0,0)
Pad_e48120
  round 0.508 hole 0.457: 124(0,0)
Pad_e48121
  round 0.508 hole 0.457: 125(0,0)
Pad_e48123
  round 0.508 hole 0.457: 126(0,0)
Pad_e48124
  round 0.508 hole 0.457: 127(0,0)
Pad_e48570
  round 0.508 hole 0.457: 128(0,0)
RES-TH_BD2.4-L6.3-P10.30-D0.6
  round 1.524 hole 1: 1(-5.15,0) 2(5.15,0)
SENSOR-TH_DHT11
  rect 1.296x1.296 hole 0.711: 1(-3.81,0)
  round 1.296 hole 0.711: 2(-1.27,0) 3(1.27,0) 4(3.81,0)
STC8H8K64U_CORE
  round 1.6 hole 0.914x1.049: 1(-7.62,30.48) 2(-7.62,27.94) 3(-7.62,25.4) 4(-7.62,22.86) 5(-7.62,20.32) 6(-7.62,17.78) 7(-7.62,15.24) 8(-7.62,12.7) 9(-7.62,10.16) 10(-7.62,7.62) 11(-7.62,5.08) 12(-7.62,2.54) 13(-7.62,0) 14(-7.62,-2.54) 15(-7.62,-5.08) 16(-7.62,-7.62) 17(-7.62,-10.16) 18(-7.62,-12.7) 19(-7.62,-15.24) 20(-7.62,-17.78) 21(-7.62,-20.32) 22(-7.62,-22.86) 23(-7.62,-25.4) 24(-7.62,-27.94) 25(-7.62,-30.48) 26(7.62,30.48) 27(7.62,27.94) 28(7.62,25.4) 29(7.62,22.86) 30(7.62,20.32) 31(7.62,17.78) 32(7.62,15.24) 33(7.62,12.7) 34(7.62,10.16) 35(7.62,7.62) 36(7.62,5.08) 37(7.62,2.54) 38(7.62,0) 39(7.62,-2.54) 40(7.62,-5.08) 41(7.62,-7.62) 42(7.62,-10.16) 43(7.62,-12.7) 44(7.62,-15.24) 45(7.62,-17.78) 46(7.62,-20.32) 47(7.62,-22.86) 48(7.62,-25.4) 49(7.62,-27.94) 50(7.62,-30.48)
SW-TH_4P-L6.0-W6.0-P4.50-LS6.5
  round 1.8 hole 1.2: 1(-3.25,2.25) 2(3.25,2.25) 3(-3.25,-2.25) 4(3.25,-2.25)

## Nets
As in the schematic, except:
GND: C1.1 C2.1 NOREF.123 NOREF#2.111 NOREF#3.51 NOREF#4.54 NOREF#5.51 NOREF#6.80 NOREF#7.73 NOREF#8.76 NOREF#9.97 NOREF#10.72 NOREF#11.101 NOREF#12.109 NOREF#13.59 NOREF#14.71 NOREF#15.68 NOREF#16.102 NOREF#17.63 NOREF#18.96 NOREF#19.53 NOREF#20.92 NOREF#21.124 NOREF#22.52 NOREF#23.93 NOREF#24.56 NOREF#25.90 NOREF#26.95 NOREF#27.79 NOREF#28.105 NOREF#29.127 NOREF#30.88 NOREF#31.83 NOREF#32.67 NOREF#33.85 NOREF#34.78 NOREF#35.103 NOREF#36.64 NOREF#37.74 NOREF#38.106 NOREF#39.98 NOREF#40.100 NOREF#41.118 NOREF#42.69 NOREF#43.128 NOREF#44.94 NOREF#45.70 NOREF#46.62 NOREF#47.60 NOREF#48.113 NOREF#49.81 NOREF#50.121 NOREF#51.115 NOREF#52.66 NOREF#53.58 NOREF#54.125 NOREF#55.119 NOREF#56.61 NOREF#57.87 NOREF#58.57 NOREF#59.65 NOREF#60.84 NOREF#61.112 NOREF#62.120 NOREF#63.75 NOREF#64.104 NOREF#65.86 NOREF#66.55 NOREF#67.110 NOREF#68.126 NOREF#69.99 NOREF#70.117 NOREF#71.114 NOREF#72.89 NOREF#73.77 NOREF#74.122 NOREF#75.91 NOREF#76.107 NOREF#77.116 NOREF#78.108 NOREF#79.82 SW1.3 SW1.4 SW2.3 SW2.4 SW3.3 SW3.4 SW4.3 SW4.4 U1.6 U3.25 U3.50 U6.1 U7.4 U8.8 U8.13 U9.8 U9.13 U10.4

Pads without a net: U3 2 3 4 5 6 8 11 14 15 16 17 20 21 23 27 28 29 30 31 33 34 35 36 37 38 39 40 45 47 48; U7 3; U9 9; U10 7

## Via types
v1: diameter 0.61, hole 0.305, Top Layer to Bottom Layer, 164 vias

## Routing (per net, layer and track width the routed paths; a pad name or vN(x,y) marks a point on that pad's centre or on a via; arc(x,y) is an arc through that point)
3V3: length 8.6
  Top Layer w0.381: U1.7 56.64,27.19 56.64,33.45 58.01,33.45 U3.24
5V: length 72.1
  Top Layer w0.381: U3.49 37.47,27.83 v1(37.47,27.74) ; v1(76.33,15.04) 74.42,13.13 41.4,13.13 40.63,13.91 40.63,15.81 40.13,16.31 40.13,21.13 v1(36.2,25.07)
  Bottom Layer w0.381: v1(36.2,25.07) 36.2,26.47 v1(37.47,27.74) ; U6.3 83.57,7.8 v1(76.33,15.04)
GND: length 2.1
  Top Layer w0.254: 70.2,16.31 69.22,16.31 69.05,16.47 SW4.3
VBAT: length 114.4
  Top Layer w0.381: U6.2 87.12,11.35 74.55,23.93 38.48,23.93 33.78,28.63 33.78,68.04 D2.2
VCC: length 172.5
  Top Layer w0.381: U9.10 33.15,47.55 33.15,63.72 D1.2
  Bottom Layer w0.381: R4.1 85.16,64.38 U7.1 ; D1.2 28.39,70.92 R21.1 ; R23.1 37.03,79.81 R21.1 ; U8.16 82.93,31.17 82.93,41.96 81.03,43.87 ; R21.1 37.15,79.36 41.44,75.08 45.37,75.08 47.88,72.57 58.8,72.57 69.72,61.65 U7.1 ; U7.1 84.71,61.65 87,59.36 87,49.58 81.28,43.87 81.03,43.87 ; 81.03,43.87 U8.10 ; U9.16 30.1,29.26 30.1,33.83 29.72,34.21 27.69,34.21 27.05,34.85 27.05,41.45 U9.10
A: length 273.8
  Top Layer w0.254: v1(77.6,18.59) 77.6,14.02 LED25.1 75.06,11.48 46.23,11.48 LED33.1 40.01,6.15 37.85,8.31 37.85,10.97 35.69,13.13 35.69,22.75 28.83,29.6 U9.15 24,25.7 10.29,25.7 LED41.1 11.48,29.95 11.48,58.29 5.84,63.93 LED49.1 8.64,68 10.8,68 23.62,80.82 23.62,83.11 31.5,90.98 LED57.1 33.15,91.49 37.21,91.49 38.86,93.14 45.85,93.14 LED1.1 52.83,93.27 65.02,93.27 71.88,86.41 76.2,86.41 79.88,82.73 82.17,82.73 83.19,81.71 ; v1(79.76,20.88) 89.41,30.53 89.41,39.04 LED17.1
  Bottom Layer w0.254: v1(79.76,20.88) 79.76,20.75 v1(77.6,18.59)
B: length 295.2
  Top Layer w0.254: LED50.1 11.18,73.58 11.18,79.05 24.26,92.13 26.29,92.13 27.94,93.78 29.72,93.78 31.37,95.43 34.92,95.43 LED58.1 38.48,97.21 38.73,97.21 39.37,97.84 52.45,97.84 LED2.1 56.13,94.16 61.09,94.16 61.34,94.41 61.34,94.67 62.74,96.06 66.42,96.06 68.71,93.78 68.71,90.35 72.26,86.79 76.58,86.79 79.88,83.49 82.93,83.49 84.33,82.09 84.33,79.43 85.73,78.03 86.23,78.03 ; LED42.1 6.73,31.55 9.4,34.21 v1(9.4,36.63) ; U9.1 16.51,32.69 15.49,32.69 v1(13.84,34.34) ; v1(26.42,15.67) 28.58,15.67 35.43,8.81 35.43,6.27 LED34.1 39.24,2.46 68.07,2.46 71.12,5.51 LED26.1 75.44,4.88 93.09,4.88 94.87,6.66 94.87,33.45 94.23,34.09 94.23,39.67 LED18.1
  Bottom Layer w0.254: LED50.1 6.98,69.39 6.98,64.82 9.78,62.03 9.78,37.01 v1(9.4,36.63) 10.67,36.63 12.95,34.34 v1(13.84,34.34) ; U9.1 26.42,22.78 v1(26.42,15.67)
C: length 284.1
  Top Layer w0.254: v1(33.15,88.95) 36.58,88.95 v1(39.88,92.25) ; v1(56.01,92.38) 55.12,91.49 v1(51.44,91.49) ; v1(13.59,36.37) 18.92,31.04 20.7,31.04 U9.2 ; v1(77.98,22.78) 78.87,22.78 v1(88.77,32.69) ; v1(76.2,20.88) 76.2,17.7 v1(73.03,14.53) ; LED59.1 41.02,95.3 v1(41.02,93.9) ; v1(27.94,88.44) 21.97,82.47 21.97,80.95 15.24,74.22 14.73,74.22 12.83,72.31 v1(11.3,72.31) 11.3,71.68 v1(12.19,70.79) ; v1(56.64,94.79) 57.4,94.79 LED3.1 59.94,97.33 74.3,97.33 91.19,80.44 91.19,75.87 LED11.1 ; v1(67.56,1.45) 37.72,1.45 LED35.1 31.24,9.83 v1(24.38,16.69) ; v1(68.2,4.37) 68.2,6.02 LED27.1 ; LED43.1 6.86,37.64 v1(10.67,37.64) 11.05,38.02 11.05,57.71 v1(10.67,58.09)
  Bottom Layer w0.254: v1(77.98,22.78) 77.98,22.66 v1(76.2,20.88) ; v1(56.01,92.38) 56.64,93.02 v1(56.64,94.79) ; v1(73.03,14.53) 73.03,13.13 LED27.1 ; v1(24.38,16.69) 23.37,16.69 19.69,20.37 19.69,29.01 U9.2 ; v1(10.67,58.09) 10.67,66.98 12.7,69.01 12.7,70.28 v1(12.19,70.79) ; v1(27.94,88.44) 32.64,88.44 v1(33.15,88.95) ; v1(11.3,72.31) 9.78,73.84 LED51.1 ; v1(13.59,36.37) 11.94,36.37 v1(10.67,37.64) ; v1(67.56,1.45) 67.56,3.73 v1(68.2,4.37) ; LED19.1 91.19,35.1 v1(88.77,32.69) ; v1(51.44,91.49) 49.02,93.9 v1(41.02,93.9) 41.02,93.4 v1(39.88,92.25)
COM0: length 115.7
  Bottom Layer w0.254: LED2.2 56.39,96.06 ; 56.39,96.06 58.17,94.28 58.56,94.67 59.83,94.67 LED3.2 60.83,94.79 62.36,93.27 64.14,93.27 LED4.2 68.2,94.54 LED5.2 72.14,92.89 74.3,90.73 75.82,90.73 LED7.2 79.38,88.06 LED8.2 81.53,84.12 81.53,74.35 86.49,69.39 86.49,60.46 87.41,59.53 87.41,49.41 82.08,44.08 82.08,43.4 83.35,42.14 83.35,30.99 82.59,30.23 82.59,29.3 79.38,26.09 77.85,26.09 76.71,27.22 76.71,30.28 77.6,31.17 U8.15 ; 56.39,96.06 56.39,95.94 55.5,95.05 53.59,95.05 51.94,96.7
COM1: length 76.7
  Bottom Layer w0.254: U8.1 74.8,28.63 77.72,25.7 79.5,25.7 82.95,29.15 82.95,30.09 83.71,30.84 83.71,35.37 LED16.2 97.92,49.83 LED15.2 97.92,58.85 LED14.2 95.76,61.01 LED13.2 95.76,67.36 LED12.2 93.73,71.55 91.57,73.71 91.57,75.23 LED10.2 88.77,78.66 LED9.2
COM2: length 62.2
  Bottom Layer w0.254: LED23.2 81.66,14.53 LED24.2 ; LED23.2 85.09,18.47 LED22.2 91.19,24.56 LED21.2 93.6,28.25 LED20.2 95.5,32.31 LED19.2 96.9,36.5 LED18.2 97.66,40.56 97.66,44.75 ; LED23.2 84.2,17.96 74.93,27.23 71.12,27.23 69.34,29.01 69.34,30.02 70.36,31.04 72.64,31.04 U8.2
COM3: length 68
  Top Layer w0.254: v1(68.07,27.23) 68.07,30.91 70.87,33.71 U8.3
  Bottom Layer w0.254: v1(68.07,27.23) 70.1,25.2 70.1,19.23 LED25.2 75.31,9.19 LED26.2 71.63,7.16 LED27.2 68.2,5.77 LED28.2 64.26,4.62 LED29.2 59.44,6.15 57.15,6.15 56.39,5.38 LED30.2 54.48,2.08 52.96,2.08 52.07,2.97 52.07,3.48 LED31.2 50.17,5.38 48.01,5.38 LED32.2
COM4: length 99.1
  Top Layer w0.254: v1(68.45,25.2) 71.25,27.99 v1(71.25,31.93)
  Bottom Layer w0.254: LED40.2 17.4,20.12 LED39.2 17.78,19.35 LED38.2 LED37.2 26.54,12.37 LED36.2 31.88,9.83 LED35.2 34.54,8.69 35.56,8.69 LED34.2 39.12,7.16 40.64,7.16 LED33.2 43.43,6.15 55.37,6.15 69.47,20.24 69.47,24.18 v1(68.45,25.2) ; U8.4 72.52,35.99 66.42,35.99 65.53,35.1 65.53,34.72 66.17,34.09 69.09,34.09 v1(71.25,31.93)
COM5: length 125.8
  Top Layer w0.254: U8.5 74.42,37.14 v1(74.42,25.96) ; v1(64.64,19.35) 67.69,22.4 v1(74.42,22.4)
  Bottom Layer w0.254: v1(74.42,22.4) v1(74.42,25.96) ; LED48.2 6.86,56.31 LED47.2 5.33,54.79 LED46.2 5.97,49.96 LED45.2 6.86,44.75 LED44.2 8,39.8 LED43.2 9.02,35.23 9.02,29.52 LED41.2 11.94,27.23 25.78,13.39 27.05,13.39 33.02,19.35 v1(64.64,19.35)
COM6: length 118.9
  Top Layer w0.254: v1(76.58,42.85) 74.04,45.39 v1(74.04,46.15) ; v1(71.12,48.95) 67.69,52.38 57.79,52.38 57.53,52.12 56.64,52.12 54.1,54.66 54.1,65.33 51.56,67.87 v1(51.56,74.47)
  Bottom Layer w0.254: v1(76.58,42.85) 75.06,41.33 U8.6 ; v1(71.12,48.95) 71.76,48.95 74.04,46.66 v1(74.04,46.15) ; LED49.2 10.03,66.85 LED50.2 12.32,72.19 LED51.2 15.24,77.14 LED52.2 18.67,81.71 19.18,81.71 LED54.2 25.65,88.19 LED55.2 26.92,88.32 LED56.2 32.39,91.11 40.64,82.86 44.45,82.86 51.56,75.74 v1(51.56,74.47)
COM7: length 89.5
  Top Layer w0.254: v1(55.5,74.22) 55.5,69.14 57.02,67.61 59.31,67.61 78.36,48.56 78.36,45.26 v1(79.12,44.5)
  Bottom Layer w0.254: v1(55.5,74.22) 55.5,88.32 47.37,96.44 45.34,94.41 44.83,94.41 43.86,95.38 43.86,96.06 LED59.2 41.28,94.54 LED58.2 36.96,93.14 LED57.2 ; v1(79.12,44.5) 78.49,43.87 U8.7
COMD: length 291.2
  Top Layer w0.254: v1(77.47,23.55) 78.74,23.55 v1(86.11,30.91) ; v1(10.41,40.56) 8.26,42.72 8,42.72 ; LED44.1 4.32,41.07 5.97,42.72 8,42.72 ; LED36.1 25.91,10.47 v1(25.91,14.28) ; v1(10.03,76.76) 10.03,76.5 8.64,75.11 8.64,73.2 5.84,70.41 5.84,67.74 4.57,66.47 4.57,64.57 8,61.14 8,42.72 ; v1(75.44,21.51) 75.44,18.85 v1(72.26,15.67) ; v1(65.53,91.62) 87.76,69.39 LED12.1 ; LED28.1 63.37,5.77 v1(65.66,3.48) 66.55,4.37 66.55,6.15 65.53,7.16 65.53,8.43 67.82,10.72 v1(69.6,10.72) ; LED4.1 63.88,94.54 65.02,95.68 66.04,95.68 66.55,95.17 66.55,93.78 v1(66.04,93.27)
  Bottom Layer w0.254: v1(25.91,14.28) 27.31,15.67 27.31,22.78 25.65,24.44 25.65,28.63 U9.3 13.72,40.56 v1(10.41,40.56) ; v1(65.66,3.48) 65.66,3.35 63.88,1.57 34.8,1.57 LED36.1 ; v1(65.53,91.62) 65.53,92.76 v1(66.04,93.27) ; LED4.1 65.28,96.95 65.28,98.09 64.26,99.11 47.5,99.11 LED60.1 44.07,97.21 39.88,97.21 39.12,96.44 39.12,96.19 30.48,96.19 24.77,90.47 23.37,90.47 14.73,81.84 14.73,80.31 LED52.1 11.18,76.76 v1(10.03,76.76) ; v1(72.26,15.67) 69.6,13 v1(69.6,10.72) ; v1(86.11,30.91) 90.55,30.91 LED20.1 ; v1(75.44,21.51) v1(77.47,23.55)
COME: length 282.2
  Top Layer w0.254: v1(92.71,41.33) 89.92,38.53 89.92,30.15 88.65,28.88 LED21.1 93.47,21.01 v1(93.47,8.43) ; v1(66.17,89.97) 66.17,89.84 91.19,64.82 LED13.1 92.84,64.44 92.84,45.14 v1(93.6,44.37) ; LED53.1 17.53,80.31 v1(17.53,79.05) ; LED37.1 22.23,19.99 v1(17.53,24.69) ; LED29.1 60.2,2.84 66.42,2.84 v1(66.8,3.23) ; v1(10.41,54.92) 9.53,54.92 8.38,53.77 8.38,48.18 v1(8.64,47.93) 8.64,46.79 v1(10.41,45.01) ; v1(12.07,43.87) 12.07,39.17 17.27,33.96 v1(18.92,33.96) 19.56,33.96 U9.4 ; v1(6.73,47.55) 5.33,47.55 LED45.1
  Bottom Layer w0.254: v1(92.71,41.33) 92.71,43.48 v1(93.6,44.37) ; v1(17.53,79.05) 17.53,73.2 14.73,70.41 14.73,59.23 v1(10.41,54.92) ; v1(8.64,47.93) 8.26,47.55 v1(6.73,47.55) ; v1(18.92,33.96) 17.53,32.56 v1(17.53,24.69) ; v1(66.17,89.97) 67.31,91.11 LED5.1 ; v1(12.07,43.87) 10.92,45.01 v1(10.41,45.01) ; v1(93.47,8.43) 90.04,5 67.69,5 66.8,4.12 v1(66.8,3.23) 65.53,1.96 65.41,1.96 64.39,0.94 33.66,0.94 LED37.1
COMF: length 278.9
  Top Layer w0.254: v1(92.08,47.68) 84.33,39.93 v1(84.33,30.78) ; LED38.1 18.54,18.09 v1(20.7,20.24) ; LED54.1 20.57,84.12 v1(20.57,81.58) ; v1(21.59,77.65) 13.97,70.03 v1(13.97,56.95) ; LED46.1 3.3,50.09 3.3,49.33 6.1,49.33 v1(6.98,50.22) ; v1(88.9,70.66) 88.9,71.81 v1(80.26,80.44) ; v1(27.43,30.53) 22.35,35.61 22.35,37.26 21.46,38.15 U9.5 ; v1(27.43,27.99) 27.43,27.86 v1(21.72,22.15) 27.56,16.31 29.97,16.31 36.83,9.45 36.83,5.64 39.12,3.35 40.26,3.35 41.4,4.5 41.4,5.64 42.42,6.66 51.18,6.66 LED30.1 ; v1(10.41,49.2) 9.14,50.47 v1(9.14,51.61) 10.03,52.5 v1(10.41,52.5) ; LED22.1 88.27,19.1 88.27,6.53 87.5,5.77 78.99,5.77 74.17,10.59 70.87,10.59 69.6,9.32 v1(67.82,9.32)
  Bottom Layer w0.254: v1(67.82,9.32) 59.18,9.32 LED30.1 ; v1(21.59,77.65) 21.59,80.57 v1(20.57,81.58) ; v1(21.72,22.15) 20.7,21.13 v1(20.7,20.24) ; v1(10.41,49.2) 10.41,48.95 U9.5 ; v1(27.43,27.99) v1(27.43,30.53) ; v1(80.26,80.44) 80.26,82.22 LED6.1 ; v1(88.9,70.66) 88.9,65.33 LED14.1 92.08,57.07 v1(92.08,47.68) ; v1(13.97,56.95) 13.97,56.06 v1(10.41,52.5) ; v1(9.14,51.61) 8.38,51.61 v1(6.98,50.22) ; v1(84.33,30.78) 84.33,23.04 LED22.1
COMG: length 272.7
  Top Layer w0.254: U9.6 17.78,37.26 v1(16.13,37.26) 16.13,51.23 v1(12.07,55.3) 12.07,67.36 v1(13.21,68.5) ; v1(87.5,29.9) 87.5,30.4 v1(88.77,31.67) ; v1(79.5,90.35) 78.23,90.35 LED7.1 ; v1(16.13,24.44) 16.13,20.62 LED39.1 14.86,17.32 30.23,1.96 34.29,1.96 v1(34.8,2.46) ; v1(74.04,19.23) 73.91,19.23 v1(70.48,15.8) ; LED31.1 50.17,2.84 54.48,2.84 55.25,3.61 55.25,4.75 60.71,10.21 v1(66.04,10.21) ; v1(6.1,53.14) 3.81,55.42 LED47.1 ; v1(88.65,39.42) 88.65,42.47 v1(91.31,45.14) ; v1(24.26,85.78) 24.26,87.17 LED55.1 ; v1(10.41,53.77) 9.78,53.77 v1(9.02,53.01) ; v1(87.5,27.48) 82.55,22.53 LED23.1
  Bottom Layer w0.254: v1(74.04,19.23) 74.42,19.23 76.71,16.94 81.53,16.94 LED23.1 ; v1(91.31,45.14) 93.98,47.8 93.98,52.76 95.38,54.15 LED15.1 95.89,55.3 95.89,60.25 94.36,61.77 94.36,66.98 92.58,68.76 92.58,70.28 90.04,72.82 90.04,73.48 90.42,73.86 90.42,74.6 87.38,77.65 87.38,78.79 85.73,80.44 84.84,80.44 84.33,80.95 84.33,85.52 v1(79.5,90.35) ; v1(34.8,2.46) 47.5,2.46 LED31.1 ; v1(88.65,39.42) 88.14,38.91 88.14,32.31 v1(88.77,31.67) ; v1(87.5,27.48) v1(87.5,29.9) ; v1(6.1,53.14) 6.22,53.01 v1(9.02,53.01) ; v1(12.07,55.3) 10.54,53.77 v1(10.41,53.77) ; v1(16.13,24.44) v1(16.13,37.26) ; v1(66.04,10.21) 70.48,14.66 v1(70.48,15.8) ; v1(13.21,68.5) 13.21,73.46 13.46,73.71 13.46,74.47 16.76,77.78 16.76,79.17 17.27,79.68 18.67,79.68 19.94,80.95 19.94,81.97 21.46,83.49 22.48,83.49 24.26,85.27 v1(24.26,85.78)
COMH: length 289.4
  Top Layer w0.254: LED40.1 13.34,24.94 v1(15.24,24.94) ; v1(77.72,8.56) 78.99,9.83 LED24.1 ; v1(15.11,45.64) 15.49,45.26 15.49,39.17 v1(14.73,38.41) ; v1(80.9,80.95) 86.49,75.36 86.49,74.73 89.41,71.81 89.41,71.04 89.79,70.66 91.57,70.66 92.2,70.03 92.2,69.77 92.46,69.52 92.46,67.49 94.61,65.33 94.61,61.14 95.89,59.87 95.89,56.82 96.52,56.19 96.52,50.72 LED16.1 96.27,48.95 96.27,43.99 90.42,38.15 90.42,33.07 92.33,31.17 92.33,29.77 91.44,28.88 91.44,27.33 92.84,25.94 92.84,23.93 v1(92.33,23.42) ; v1(12.7,63.42) 12.7,56.44 v1(15.11,54.03) ; v1(8.38,62.53) 9.14,63.3 v1(11.3,63.3) ; v1(16.38,76.25) 21.34,81.2 21.34,82.22 21.08,82.47 21.08,87.94 24.26,91.11 LED56.1 ; v1(34.67,3.48) 37.47,0.69 68.45,0.69 68.45,2.21 v1(72.26,6.02)
  Bottom Layer w0.254: U9.7 18.8,45.64 v1(15.11,45.64) v1(15.11,54.03) ; v1(72.26,6.02) 75.18,6.02 v1(77.72,8.56) ; LED40.1 11.43,23.04 11.43,21.13 16.26,16.31 16.51,16.31 18.42,14.4 21.97,14.4 23.5,12.88 23.5,11.73 24,11.23 26.42,11.23 26.54,11.35 27.81,10.08 27.81,9.19 33.53,3.48 v1(34.67,3.48) 34.92,3.73 43.82,3.73 LED32.1 ; v1(11.3,63.3) 11.43,63.42 v1(12.7,63.42) 14.22,64.95 14.22,72.57 16.38,74.73 v1(16.38,76.25) ; v1(92.33,23.42) 84.96,16.05 84.96,15.42 82.3,12.75 80.9,12.75 79.12,14.53 LED24.1 ; v1(14.73,38.41) 15.24,37.9 v1(15.24,24.94) ; v1(80.9,80.95) 80.9,84 LED8.1 ; v1(8.38,62.53) 6.6,62.53 LED48.1
DH: length 53.3
  Top Layer w0.381: U7.2 79.63,59.11 74.86,63.88 R4.2
  Bottom Layer w0.381: 59.44,76.5 59.56,76.38 59.56,75.74 58.93,75.11 57.4,75.11 55.5,73.2 51.82,73.2 48.55,76.47 U3.32 ; 59.44,76.5 59.31,76.63 ; 59.44,76.5 67.24,76.5 R4.2 ; 59.44,76.5 59.31,76.5
KEY1: length 53.7
  Top Layer w0.381: v1(34.8,25.32) 38.3,21.82 SW1.1 ; v1(35.81,35.86) 37.08,37.14 45.85,37.14 48.39,34.59 v1(48.39,31.17) ; v1(51.18,33.71) 55.85,38.37 U3.22
  Bottom Layer w0.381: v1(34.8,25.32) 34.8,34.85 v1(35.81,35.86) ; SW1.2 SW1.1 ; v1(48.39,31.17) 50.93,33.71 v1(51.18,33.71)
KEY2: length 125
  Top Layer w0.381: v1(68.07,44.88) 70.1,44.88 v1(71.5,43.48) ; v1(53.98,75.11) 53.98,69.27 v1(54.48,68.76)
  Bottom Layer w0.381: v1(68.07,44.88) 68.07,61.9 v1(62.86,67.11) 62.36,67.61 55.63,67.61 v1(54.48,68.76) ; v1(53.98,75.11) 53.98,80.66 U3.26 ; SW2.2 SW2.1 50.34,22.94 61.67,22.94 64.24,25.5 64.24,26.67 58.85,32.05 57.15,32.05 55.88,33.33 55.88,38.91 56.52,39.55 67.56,39.55 v1(71.5,43.48)
KEY3: length 109.2
  Top Layer w0.381: v1(61.14,31.8) 68.63,39.29 v1(70.99,39.29) ; v1(53.09,68.5) 52.45,69.14 52.45,86 U3.1 ; v1(70.99,41.83) 69.47,43.36 64.14,43.36 v1(63.88,43.61)
  Bottom Layer w0.381: v1(63.88,43.61) 63.88,59.87 58.67,65.08 56.52,65.08 v1(53.09,68.5) ; SW3.1 SW3.2 53.44,22.45 61.87,22.45 64.72,25.3 64.72,26.87 61.14,30.45 v1(61.14,31.8) ; v1(70.99,39.29) v1(70.99,41.83)
KEY4: length 75.5
  Top Layer w0.381: v1(55.12,62.53) 59.69,62.53 v1(79.12,43.1) ; v1(66.93,34.85) 67.06,34.72 v1(67.06,26.09)
  Bottom Layer w0.381: 61.94,20.97 SW4.1 ; 61.94,20.97 SW4.2 ; 61.94,20.97 v1(67.06,26.09) ; v1(79.12,43.1) 79.12,40.18 73.79,34.85 v1(66.93,34.85) ; U3.13 56.42,61.23 v1(55.12,62.53)
NIX_DI: length 48.2
  Top Layer w0.381: v1(50.8,51.49) 52.58,51.49 56.77,47.3 59.18,47.3 66.29,40.18 73.91,40.18 U8.14 ; v1(45.85,54.79) 45.85,53.99 U3.42
  Bottom Layer w0.381: v1(50.8,51.49) 47.5,54.79 v1(45.85,54.79)
NIX_RCK: length 85.3
  Top Layer w0.381: v1(48.26,55.55) 45.55,52.84 v1(45.55,51.23) 45.55,51.15 U3.43 ; U8.12 76.58,38.79 74.68,40.69 74.68,41.07 73.28,42.47 71.12,42.47 70.23,43.36 70.23,43.48 69.85,43.87 68.09,43.87 65.3,46.66 v1(60.96,46.66) ; v1(48.39,42.98) v1(48.39,48.56) ; v1(36.45,38.28) 40.51,38.28 41.91,39.67 44.45,39.67 v1(45.72,40.94) ; v1(50.29,54.41) 52.45,52.25 v1(53.21,52.25)
  Bottom Layer w0.381: v1(60.96,46.66) 58.93,44.63 54.1,44.63 54.1,51.36 v1(53.21,52.25) ; v1(50.29,54.41) 49.4,54.41 v1(48.26,55.55) ; U9.12 36.32,38.15 v1(36.45,38.28) ; v1(45.55,51.23) 48.21,48.56 v1(48.39,48.56) ; v1(45.72,40.94) 46.36,40.94 v1(48.39,42.98)
NIX_SCK: length 84.2
  Top Layer w0.381: v1(76.71,39.8) 78.23,41.33 U8.11 ; U3.44 45.34,43.58 v1(45.34,42.85) ; v1(46.61,39.42) 46.61,41.58 v1(45.34,42.85) ; v1(52.45,24.82) 46.48,24.82 45.85,25.45 45.85,28.5 45.08,29.26 v1(45.08,33.07) ; v1(45.34,42.85) 44.54,42.05 41.88,42.05 40.64,40.82 v1(36.2,40.82) ; v1(70.87,37.14) 68.2,37.14 66.04,34.98 66.04,31.29 v1(61.6,26.85)
  Bottom Layer w0.381: v1(36.2,40.82) 36.07,40.69 U9.11 ; v1(46.61,39.42) 46.61,34.59 v1(45.08,33.07) ; v1(52.45,24.82) 59.56,24.82 v1(61.6,26.85) ; v1(70.87,37.14) 71.25,37.52 74.42,37.52 v1(76.71,39.8)
P13: length 45.1
  Top Layer w0.381: v1(48.89,61.14) 49.53,60.5 U1.4
  Bottom Layer w0.381: U3.12 51.53,63.77 v1(48.89,61.14)
P15: length 71.1
  Top Layer w0.381: v1(60.83,43.99) 59.94,43.1 59.94,27.61 57.4,25.07 53.69,25.07 U1.5 ; v1(72.64,58.34) 59.6,71.39 U3.9
  Bottom Layer w0.381: v1(60.83,43.99) 62.1,42.72 67.31,42.72 69.22,44.63 69.22,54.92 v1(72.64,58.34)
P16: length 54.4
  Top Layer w0.381: v1(50.67,69.52) 50.67,67.23 52.45,65.46 v1(52.45,62.28)
  Bottom Layer w0.381: U3.10 56.48,70.54 51.69,70.54 v1(50.67,69.52) ; v1(52.45,62.28) 52.45,32.15 U1.3
P20: length 35.4
  Bottom Layer w0.381: U1.1 50.17,34.94 50.17,49.96 46.52,53.61 U3.41
P32: length 74.2
  Top Layer w0.381: U3.18 50.29,56.41 50.29,62.41 48.51,62.41 43.56,57.45 40.01,57.45 v1(35.31,52.76) ; U10.6 28.45,56.57 28.45,65.46 23.62,70.28 23.62,77.52 25.78,79.68 R21.2
  Bottom Layer w0.381: U10.6 29.72,52.76 v1(35.31,52.76)
P33: length 98.3
  Top Layer w0.381: v1(31.62,63.42) 31.62,57.2 U10.5 ; v1(46.48,32.94) 46.48,31.42 v1(48.13,29.77) ; v1(47.5,38.41) 47.5,45.39 45.72,47.17 39.88,47.17 v1(36.83,50.22) ; v1(51.31,45.52) 51.78,45.99 U3.19
  Bottom Layer w0.381: v1(36.83,50.22) 36.83,52.88 34.42,55.3 U10.5 ; R23.2 24.51,81.02 24.51,69.65 25.4,69.65 v1(31.62,63.42) ; v1(48.13,29.77) 48.77,29.77 51.94,32.94 51.94,44.88 v1(51.31,45.52) ; v1(47.5,38.41) 47.5,33.96 v1(46.48,32.94)
P37: length 65.7
  Top Layer w0.381: v1(38.48,39.55) 40.57,39.55 41.94,40.91 U3.46
  Bottom Layer w0.381: v1(38.48,39.55) 38.61,39.67 38.61,55.8 v1(37.97,56.44) 37.97,48.06 37.47,47.55 29.97,47.55 24.64,52.88 20.96,52.88 19.05,54.79 19.05,57.33 22.99,61.27 25.27,61.27 26.92,62.92 U10.3
P47: length 74.7
  Top Layer w0.381: v1(51.05,79.17) 48.39,76.5 48.39,74.22 46.88,72.71 41.01,72.71 v1(40.51,73.2) ; v1(53.21,77.9) 56.74,77.9 U3.7
  Bottom Layer w0.381: U1.2 43.34,25.58 41.28,25.58 40.39,26.47 40.39,73.08 v1(40.51,73.2) ; v1(53.21,77.9) 51.94,79.17 v1(51.05,79.17)
SQH: length 96.6
  Bottom Layer w0.381: U9.14 26.54,30.78 26.54,24.18 27.31,23.42 61.47,23.42 63.75,25.7 63.75,26.47 60.71,29.52 56.77,29.52 54.99,31.29 54.99,40.06 57.02,42.09 68.33,42.09 71.5,45.26 79.25,45.26 U8.9
$1N7289: length 29.8
  Bottom Layer w0.381: D2.1 37.68,71.04 D1.1 37.55,65.79 32.64,60.88 27.69,60.88 U10.8
$1N7298: length 14.3
  Bottom Layer w0.381: X1.2 19.81,69.4 ; 19.81,69.4 19.81,67.74 U10.2 ; 19.81,69.4 C2.2
$1N7299: length 15.5
  Bottom Layer w0.381: 20.96,62.92 18.04,62.92 15.5,65.45 X1.1 ; 20.96,62.92 C1.2 ; 20.96,62.92 U10.1

## Copper pours and planes (outline as drawn; the poured copper is in the pictures)
GND on Top Layer: -170.81,192.2 209.8,192.2 209.8,-89.1 -170.81,-89.1
GND on Top Layer: -33.91,107.75 123.06,107.75 123.06,-7.57 -33.91,-7.57
GND on Top Layer: -26.29,104.7 114.94,104.7 114.94,-3.89 -26.29,-3.89
GND on Top Layer: -4.7,104.83 102.11,104.83 102.11,-5.66 -4.7,-5.66
GND on Top Layer: -411.35,299.77 381.13,299.77 381.13,-257.38 -411.35,-257.38
GND on Top Layer: -47.5,110.29 123.7,110.29 123.7,-6.55 -47.5,-6.55
GND on Top Layer: -4.19,104.06 101.73,104.06 101.73,-4.14 -4.19,-4.14
GND on Bottom Layer: -14.86,102.29 122.43,102.29 122.43,-2.74 -14.86,-2.74
GND on Bottom Layer: -28.07,112.19 126.36,112.19 126.36,-5.41 -28.07,-5.41
GND on Bottom Layer: -89.66,151.44 171.2,151.44 171.2,-39.83 -89.66,-39.83
GND on Bottom Layer: -268.22,230.05 289.81,230.05 289.81,-133.17 -268.22,-133.17
GND on Bottom Layer: -56.64,126.42 135.25,126.42 135.25,-9.85 -56.64,-9.85

## Text on the board
Top Silkscreen Layer: 9 | 10 | 8 | 11 | 12 | 6 | 1 | 5 | 2 | 4 | 3 | 7
